# Altium project UZ_per_cb_upgrade.PrjPcb (part 2 of 3)

## Sheet S2C.SchDoc
size A4; SheetNumber: 11
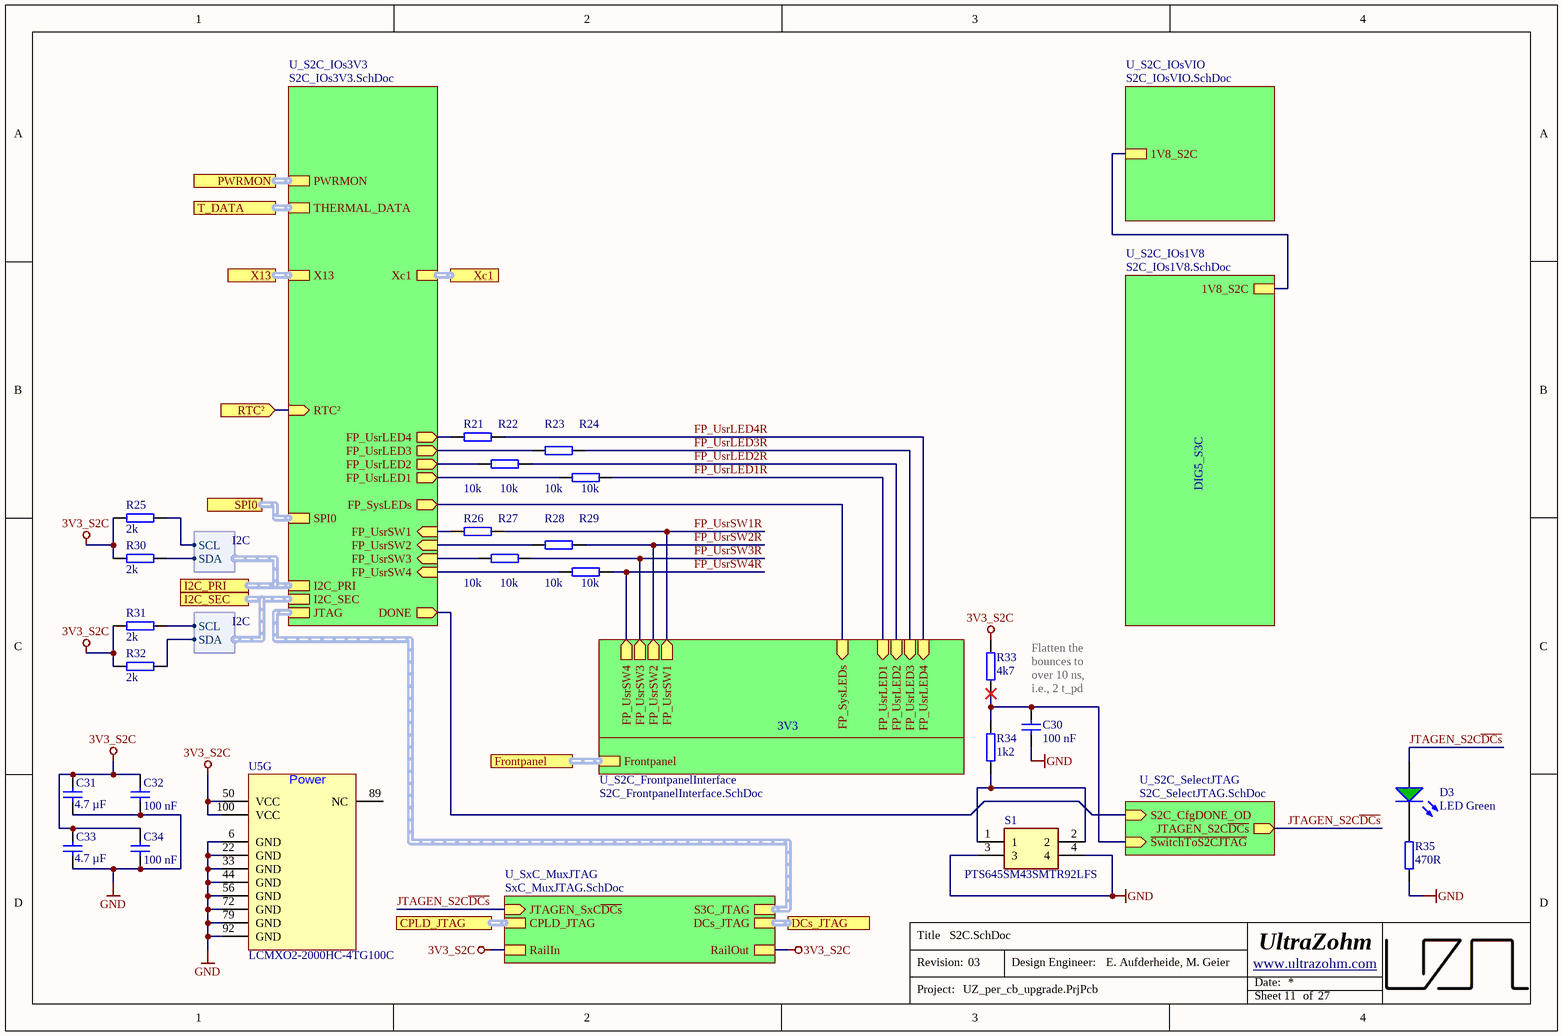
[diagram p8: S2C.SchDoc]

### Parts
C30  100 nF  [C_0603_TE]
C31  4.7 µF  [C_0603_TE]
C32  100 nF  [C_0603_TE]
C33  4.7 µF  [C_0603_TE]
C34  100 nF  [C_0603_TE]
D3  LED Green  [WL-SMCW_0603]
R21  10k  [R_0603_TE]
R22  10k  [R_0603_TE]
R23  10k  [R_0603_TE]
R24  10k  [R_0603_TE]
R25  2k  [R_0603_TE]
R26  10k  [R_0603_TE]
R27  10k  [R_0603_TE]
R28  10k  [R_0603_TE]
R29  10k  [R_0603_TE]
R30  2k  [R_0603_TE]
R31  2k  [R_0603_TE]
R32  2k  [R_0603_TE]
R33  4k7  [R_0603_TE]
R34  1k2  [R_0603_TE]
R35  470R  [R_0603_TE]
S1  PTS645SM43SMTR92LFS  [PTS645_SMT]
U5  LCMXO2-2000HC-4TG100C  [QFP50P1600X1600X160-100N]  (part G of 7)

### Sub-sheets
U_S2C_FrontpanelInterface = S2C_FrontpanelInterface.SchDoc: FP_UsrSW4 (out), FP_UsrSW3 (out), FP_UsrSW2 (out), FP_UsrSW1 (out), FP_UsrLED4 (in), FP_UsrLED3 (in), FP_UsrLED2 (in), FP_UsrLED1 (in), Frontpanel (harness Frontpanel), FP_SysLEDs (in)
U_S2C_IOs1V8 = S2C_IOs1V8.SchDoc: 1V8_S2C
U_S2C_IOs3V3 = S2C_IOs3V3.SchDoc: JTAG (harness JTAG_S3C), I2C_PRI (harness I2C), THERMAL_DATA (harness T_DATA), PWRMON (harness S2C_PWRMON), FP_UsrSW3 (in), FP_UsrSW2 (in), FP_UsrSW1 (in), FP_UsrLED1 (out), FP_SysLEDs (out), I2C_SEC (harness I2C), FP_UsrSW4 (in), FP_UsrLED2 (out), FP_UsrLED3 (out), FP_UsrLED4 (out), DONE (out), SPI0 (harness SPI0), X13 (harness X13), Xc1 (harness Xc1), RTC² (in)
U_S2C_IOsVIO = S2C_IOsVIO.SchDoc: 1V8_S2C
U_S2C_SelectJTAG = S2C_SelectJTAG.SchDoc: JTAGEN_S2C~{DCs} (out), ~{SwitchToS2CJTAG} (in), S2C_CfgDONE_OD (in)
U_SxC_MuxJTAG = SxC_MuxJTAG.SchDoc (file not in this document): CPLD_JTAG (harness JTAG), JTAGEN_SxC~{DCs} (in), S3C_JTAG (harness JTAG_S3C), DCs_JTAG (harness JTAG), RailIn, RailOut  | SubSheet_SheetNumber: 17

### Ports
CPLD_JTAG (harness JTAG), DCs_JTAG (harness JTAG), Frontpanel (harness Frontpanel), I2C_PRI (harness I2C), I2C_SEC (harness I2C), PWRMON (harness S2C_PWRMON), RTC² (in), SPI0 (harness SPI0), T_DATA (harness T_DATA), X13 (harness X13), Xc1 (harness Xc1)

### Harnesses
I2C: SCL, SDA

### Nets
3V3_S2C: C31.1 C32.2 C33.1 C34.2 R25.2 R30.2 R31.2 R32.2 R33.2 U5.50(VCC) U5.100(VCC) ; sheet U_SxC_MuxJTAG/RailIn, sheet U_SxC_MuxJTAG/RailOut
GND: C30.1 C31.2 C32.1 C33.2 C34.1 R35.2 S1.3 S1.4 U5.6(GND) U5.22(GND) U5.33(GND) U5.44(GND) U5.56(GND) U5.72(GND) U5.79(GND) U5.92(GND)
1V8_S2C: sheet U_S2C_IOs1V8/1V8_S2C, sheet U_S2C_IOsVIO/1V8_S2C
DONE: sheet U_S2C_IOs3V3/DONE, sheet U_S2C_SelectJTAG/S2C_CfgDONE_OD
FOUT: port RTC², sheet U_S2C_IOs3V3/RTC²
FP_SysLEDs: sheet U_S2C_IOs3V3/FP_SysLEDs, sheet U_S2C_FrontpanelInterface/FP_SysLEDs
FP_UsrLED1: R24.1 ; sheet U_S2C_IOs3V3/FP_UsrLED1
FP_UsrLED1R: R24.2 ; sheet U_S2C_FrontpanelInterface/FP_UsrLED1
FP_UsrLED2: R22.1 ; sheet U_S2C_IOs3V3/FP_UsrLED2
FP_UsrLED2R: R22.2 ; sheet U_S2C_FrontpanelInterface/FP_UsrLED2
FP_UsrLED3: R23.1 ; sheet U_S2C_IOs3V3/FP_UsrLED3
FP_UsrLED3R: R23.2 ; sheet U_S2C_FrontpanelInterface/FP_UsrLED3
FP_UsrLED4: R21.1 ; sheet U_S2C_IOs3V3/FP_UsrLED4
FP_UsrLED4R: R21.2 ; sheet U_S2C_FrontpanelInterface/FP_UsrLED4
FP_UsrSW1: R26.1 ; sheet U_S2C_IOs3V3/FP_UsrSW1
FP_UsrSW1R: R26.2 ; sheet U_S2C_FrontpanelInterface/FP_UsrSW1
FP_UsrSW2: R28.1 ; sheet U_S2C_IOs3V3/FP_UsrSW2
FP_UsrSW2R: R28.2 ; sheet U_S2C_FrontpanelInterface/FP_UsrSW2
FP_UsrSW3: R27.1 ; sheet U_S2C_IOs3V3/FP_UsrSW3
FP_UsrSW3R: R27.2 ; sheet U_S2C_FrontpanelInterface/FP_UsrSW3
FP_UsrSW4: R29.1 ; sheet U_S2C_IOs3V3/FP_UsrSW4
FP_UsrSW4R: R29.2 ; sheet U_S2C_FrontpanelInterface/FP_UsrSW4
JTAGEN_S2C~{DCs}: D3.2(A) ; sheet U_SxC_MuxJTAG/JTAGEN_SxC~{DCs}, sheet U_S2C_SelectJTAG/JTAGEN_S2C~{DCs}
~{SwitchToS2CJTAG}: C30.2 R33.1 R34.2 ; sheet U_S2C_SelectJTAG/~{SwitchToS2CJTAG}
NetD3_1: D3.1(K) R35.1
NetR25_1: R25.1 ; port I2C_PRI.SCL
NetR30_1: R30.1 ; port I2C_PRI.SDA
NetR31_1: R31.1 ; port I2C_SEC.SCL
NetR32_1: R32.1 ; port I2C_SEC.SDA
NetR34_1: R34.1 S1.1 S1.2

Not connected (* = marked no-connect by the designer): U5 89(NC)

### Buses and harness runs
harness port CPLD_JTAG = sheet U_SxC_MuxJTAG/CPLD_JTAG
harness port DCs_JTAG = sheet U_SxC_MuxJTAG/DCs_JTAG
harness port Frontpanel = sheet U_S2C_FrontpanelInterface/Frontpanel
harness port I2C_PRI = sheet U_S2C_IOs3V3/I2C_PRI
harness port I2C_SEC = sheet U_S2C_IOs3V3/I2C_SEC
harness port PWRMON = sheet U_S2C_IOs3V3/PWRMON
harness port SPI0 = sheet U_S2C_IOs3V3/SPI0
harness port T_DATA = sheet U_S2C_IOs3V3/THERMAL_DATA
harness port X13 = sheet U_S2C_IOs3V3/X13
harness port Xc1 = sheet U_S2C_IOs3V3/Xc1
harness sheet U_S2C_IOs3V3/JTAG = sheet U_SxC_MuxJTAG/S3C_JTAG

### Notes on the sheet
- DIG5_S3C
- Flatten the bounces to over 10 ns, i.e., 2 t_pd
- 3V3
- Title
- Revision:
- Design Engineer:
- Date:
- Project:
- Sheet
- of
- (in symbol LCMXO2-2000HC-4TG100C, part G) Power

### Library data of the parts
C30 = UZgen_C_0603_100nF_50V_X7R: Generic capacitor; Manufacturer: UZgen; Voltage: 50V; Tolerance: 10 %; Created from: AGeiger; Manufacturer Part Number: UZgen_C_0603_100nF_50V_X7R; PartID: 1; Created On: 02/07/2024 14:42:23; Value: 100 nF; Device Package: 0603; Technology: X7R; Mounting Type: SMD; Last Updated: 08/08/2024 15:01:15
C31 C33 = UZgen_C_0603_4.7uF_16V_X5R: Generic capacitor; Manufacturer: UZgen; Voltage: 16V; Tolerance: 10 %; Created from: MGeier; Manufacturer Part Number: UZgen_C_0603_4.7uF_16V_X5R; PartID: 5809; Created On: 20/03/2025 14:43:45; Value: 4.7 µF; Device Package: 0603; Technology: X5R; Mounting Type: SMD; Last Updated: 20/03/2025 14:43:45
C32 C34 = UZgen_C_0603_100nF_50V_X7R: Generic capacitor; Manufacturer: UZgen; Tolerance: 10 %; Voltage: 50 V; Created from: AGeiger; Value: 100 nF; Technology: X7R; Manufacturer Part Number: UZgen_C_0603_100nF_50V_X7R; PartID: 1; Created On: 02/07/2024 14:42:23; Device Package: 0603; Mounting Type: SMD; Last Updated: 02/08/2024 14:45:57
D3 = UZgen_LED_0603_Green: Standard LEDs - SMD 0603 green; Manufacturer: UZgen; Created from: UZgenTool; Manufacturer Part Number: UZgen_LED_0603_Green; PartID: 21; Created On: 09/09/2024 10:45:01; ComponentLink1Description: N/A; ComponentLink1URL: N/A; Component Type: LED Diode; Device Package: 0603; Last Updated: 09/09/2024 10:45:01; Mounting Type: SMD; Supplier 1: LCSC; Supplier Part Number 1: =LCSC Part Number; Type: Standard; Value: LED Green; Live Cycle Status: 1; Stock number: not stored; Color: green
R21-R24 R26-R29 = UZgen_R_0603_10k: Generic resistor; Manufacturer: UZgen; Tolerance: 1 %; Created from: AGeiger; Value: 10k; Manufacturer Part Number: UZgen_R_0603_10k; PartID: 1; Created On: 02/07/2024 14:34:53; Device Package: 0603; Mounting Type: SMD; Last Updated: 02/07/2024 14:37:16
R25 R30-R32 = UZgen_R_0603_2k: Generic resistor; Manufacturer: UZgen; Tolerance: 1 %; Created from: UZgenTool; Value: 2k; Manufacturer Part Number: UZgen_R_0603_2k; PartID: 228; Created On: 02/07/2024 17:29:49; Device Package: 0603; Mounting Type: SMD; Last Updated: 02/07/2024 17:29:49
R33 = UZgen_R_0603_4k7: Generic resistor; Manufacturer: UZgen; Tolerance: 1 %; Created from: UZgenTool; Manufacturer Part Number: UZgen_R_0603_4k7; PartID: 237; Created On: 02/07/2024 17:29:50; Value: 4k7; Device Package: 0603; Mounting Type: SMD; Last Updated: 02/07/2024 17:29:50
R34 = UZgen_R_0603_1k2: Generic resistor; Manufacturer: UZgen; Tolerance: 1 %; Created from: UZgenTool; Manufacturer Part Number: UZgen_R_0603_1k2; PartID: 223; Created On: 02/07/2024 17:29:49; Value: 1k2; Device Package: 0603; Mounting Type: SMD; Last Updated: 02/07/2024 17:29:49
R35 = UZgen_R_0603_470R: Generic resistor; Manufacturer: UZgen; Tolerance: 1 %; Created from: UZgenTool; Manufacturer Part Number: UZgen_R_0603_470R; PartID: 213; Created On: 02/07/2024 17:29:49; Value: 470R; Device Package: 0603; Mounting Type: SMD; Last Updated: 02/07/2024 17:29:49
S1 = PTS645SM43SMTR92LFS: 50mA SPST 160gf 12V SMD-4P,6x6mm Tactile Switches ROHS; Manufacturer_Name: C & K COMPONENTS; Manufacturer: C&K COMPONENTS; Value: Push Button; Created from: AGeiger; Datasheet Link: https://www.ckswitches.com/media/1471/pts645.pdf; Manufacturer_Part_Number: PTS645SM43SMTR92LFS; Mouser Part Number: 611-PTS645SM43SMTR92; Mouser Price/Stock: https://www.mouser.co.uk/ProductDetail/CK/PTS645SM43SMTR92LFS?qs=FESYatJ8odKPktxv6ncfWg%3D%3D; Arrow Part Number: PTS645SM43SMTR92LFS; Arrow Price/Stock: https://www.arrow.com/en/products/pts645sm43smtr92lfs/ck; Manufacturer Part Number: PTS645SM43SMTR92LFS; PartID: 24; Created On: 31/05/2023 15:31:02; ComponentLink1Description: Datasheet; ComponentLink1URL: https://datasheet.lcsc.com/lcsc/1810121628_C-K-PTS645SM43SMTR92LFS_C221880.pdf; Component Type: Tactile Switch; Device Package: SMD; Last Updated: 31/05/2023 15:31:02; Mounting Type: SMD; Operating Temperature: -20 to +60 °C; Supplier 1: Mouser; Supplier Part Number 1: 611-PTS645SM43SMTR92; Supplier 2: LCSC; Supplier Part Number 2: C221880; Type: Tactile Switch; Live Cycle Status: 1; LCSC Part Number: C221880
U5 = LCMXO2-2000HC-4TG100C: TQFP-100(14x14) Programmable Logic Device (CPLDs/FPGAs) ROHS; Manufacturer: Lattice; Created from: FRosner; Manufacturer Part Number: LCMXO2-2000HC-4TG100C; PartID: 37; Created On: 03/07/2024 17:33:36; ComponentLink1Description: Datasheet; ComponentLink1URL: https://wmsc.lcsc.com/wmsc/upload/file/pdf/v2/lcsc/2403111456_Lattice-LCMXO2-2000HC-4TG100C_C1521632.pdf; Component Type: CPLD; Device Package: TQFP-100; Last Updated: 23/08/2024 11:42:29; Mounting Type: SMD; Operating Temperature: -0 to +85 °C; Supplier 1: LCSC; Supplier Part Number 1: C1521632; Supplier 2: Mouser; Supplier Part Number 2: 842-XO22000HC4TG100C; Type: CPLD; Live Cycle Status: 1; LCSC Part Number: C1521632; Stock number: not stored

## Sheet S2C_IOs3V3.SchDoc
size A4; SheetNumber: 12
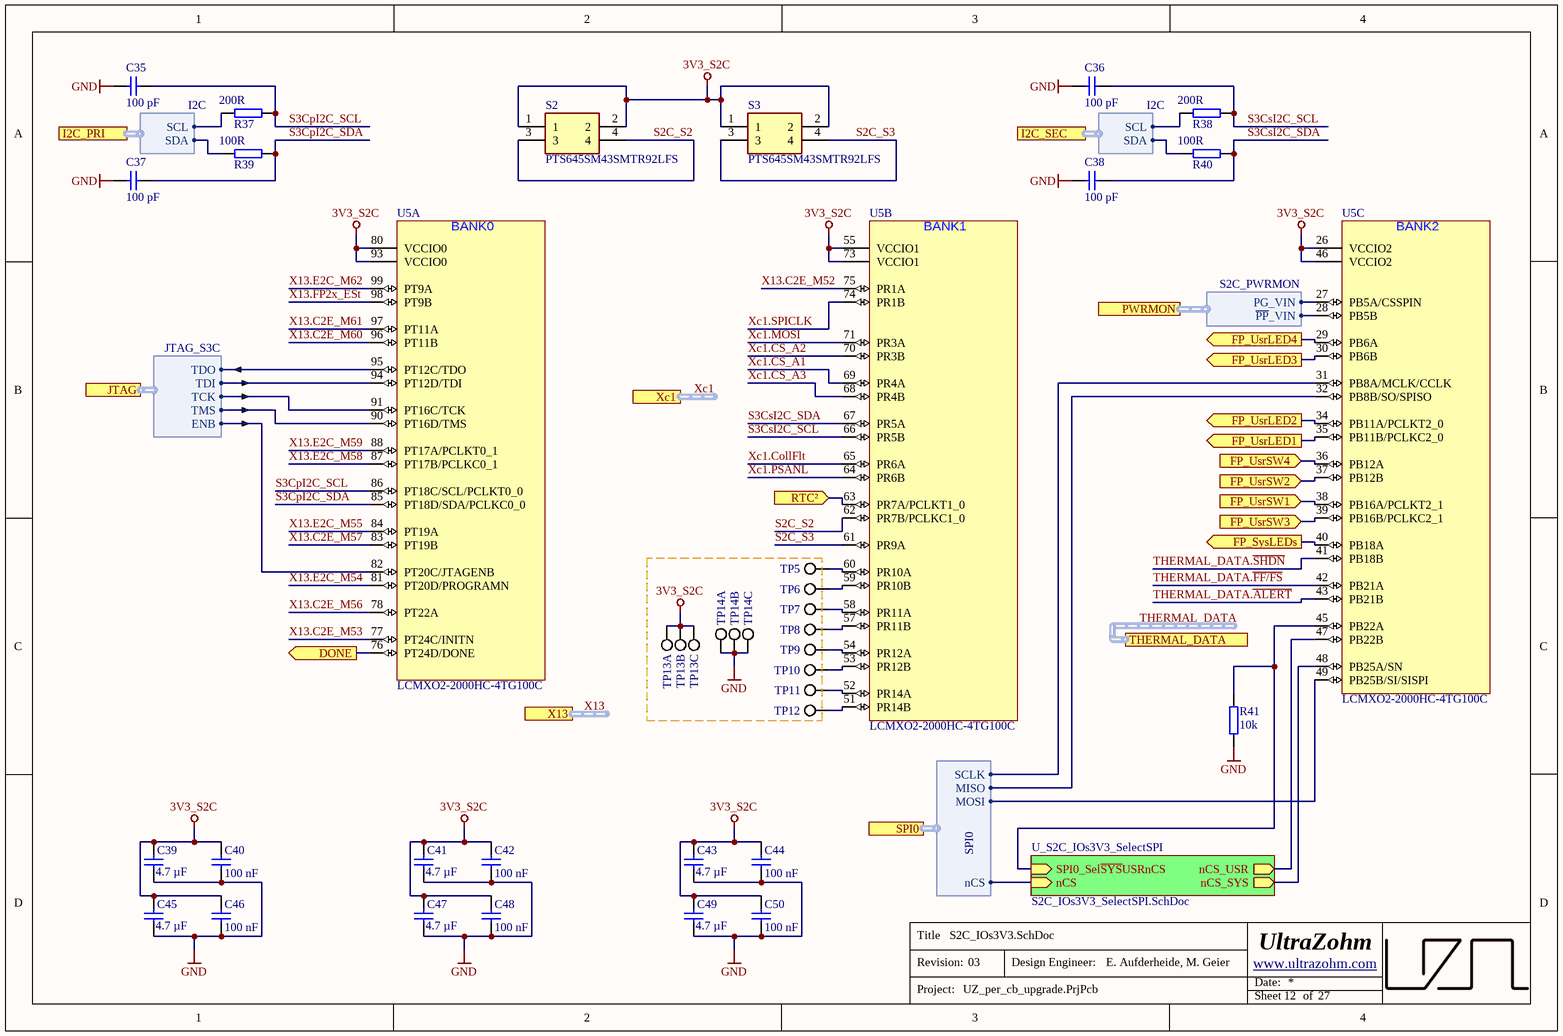
[diagram p9: S2C_IOs3V3.SchDoc]

### Parts
C35  100 pF  [C_0603_TE]
C36  100 pF  [C_0603_TE]
C37  100 pF  [C_0603_TE]
C38  100 pF  [C_0603_TE]
C39  4.7 µF  [C_0603_TE]
C40  100 nF  [C_0603_TE]
C41  4.7 µF  [C_0603_TE]
C42  100 nF  [C_0603_TE]
C43  4.7 µF  [C_0603_TE]
C44  100 nF  [C_0603_TE]
C45  4.7 µF  [C_0603_TE]
C46  100 nF  [C_0603_TE]
C47  4.7 µF  [C_0603_TE]
C48  100 nF  [C_0603_TE]
C49  4.7 µF  [C_0603_TE]
C50  100 nF  [C_0603_TE]
R37  200R  [R_0603_TE]
R38  200R  [R_0603_TE]
R39  100R  [R_0603_TE]
R40  100R  [R_0603_TE]
R41  10k  [R_0603_TE]
S2  PTS645SM43SMTR92LFS  [PTS645_SMT]
S3  PTS645SM43SMTR92LFS  [PTS645_SMT]
TP5  PR10A  [FP-5015-MFG]  (value not drawn)
TP6  PR10B  [FP-5015-MFG]  (value not drawn)
TP7  PR11A  [FP-5015-MFG]  (value not drawn)
TP8  PR11B  [FP-5015-MFG]  (value not drawn)
TP9  PR12A  [FP-5015-MFG]  (value not drawn)
TP10  PR12B  [FP-5015-MFG]  (value not drawn)
TP11  PR14A  [FP-5015-MFG]  (value not drawn)
TP12  PR14B  [FP-5015-MFG]  (value not drawn)
TP13A  3V3_S2C  [FP-5015-MFG]  (value not drawn)
TP13B  3V3_S2C  [FP-5015-MFG]  (value not drawn)
TP13C  3V3_S2C  [FP-5015-MFG]  (value not drawn)
TP14A  GND  [FP-5015-MFG]  (value not drawn)
TP14B  GND  [FP-5015-MFG]  (value not drawn)
TP14C  GND  [FP-5015-MFG]  (value not drawn)
U5  LCMXO2-2000HC-4TG100C  [QFP50P1600X1600X160-100N]  (parts A,B,C of 7)

### Sub-sheets
U_S2C_IOs3V3_SelectSPI = S2C_IOs3V3_SelectSPI.SchDoc: nCS (in), SPI0_Sel~{SYS}USRnCS (in), nCS_USR (out), nCS_SYS (out)

### Ports
DONE (out), FP_SysLEDs (out), FP_UsrLED1 (out), FP_UsrLED2 (out), FP_UsrLED3 (out), FP_UsrLED4 (out), FP_UsrSW1 (in), FP_UsrSW2 (in), FP_UsrSW3 (in), FP_UsrSW4 (in), I2C_PRI (harness I2C), I2C_SEC (harness I2C), JTAG (harness JTAG_S3C), PWRMON (harness S2C_PWRMON), RTC² (in), SPI0 (harness SPI0), THERMAL_DATA (harness T_DATA), X13 (harness X13), Xc1 (harness Xc1)

### Harnesses
JTAG_S3C: TDO, TDI, TCK, TMS, ENB
I2C: SCL, SDA
SPI0: SCLK, MOSI, MISO, nCS
S2C_PWRMON: PG_VIN, ~{PP}_VIN

### Nets
3V3_S2C: C39.1 C40.2 C41.1 C42.2 C43.1 C44.2 C45.1 C46.2 C47.1 C48.2 C49.1 C50.2 S2.1 S2.2 S3.1 S3.2 TP13A.1 TP13B.1 TP13C.1 U5.26(VCCIO2) U5.46(VCCIO2) U5.55(VCCIO1) U5.73(VCCIO1) U5.80(VCCIO0) U5.93(VCCIO0)
GND: C35.2 C36.2 C37.2 C38.2 C39.2 C40.1 C41.2 C42.1 C43.2 C44.1 C45.2 C46.1 C47.2 C48.1 C49.2 C50.1 R41.1 TP14A.1 TP14B.1 TP14C.1
DONE: U5.76(PT24D/DONE) ; port DONE
FOUT: U5.63(PR7A/PCLKT1_0) ; port RTC²
FP_SysLEDs: U5.40(PB18A) ; port FP_SysLEDs
FP_UsrLED1: U5.35(PB11B/PCLKC2_0) ; port FP_UsrLED1
FP_UsrLED2: U5.34(PB11A/PCLKT2_0) ; port FP_UsrLED2
FP_UsrLED3: U5.30(PB6B) ; port FP_UsrLED3
FP_UsrLED4: U5.29(PB6A) ; port FP_UsrLED4
FP_UsrSW1: U5.38(PB16A/PCLKT2_1) ; port FP_UsrSW1
FP_UsrSW2: U5.37(PB12B) ; port FP_UsrSW2
FP_UsrSW3: U5.39(PB16B/PCLKC2_1) ; port FP_UsrSW3
FP_UsrSW4: U5.36(PB12A) ; port FP_UsrSW4
nCS: sheet U_S2C_IOs3V3_SelectSPI/nCS, port SPI0.nCS
nCS_SYS: U5.48(PB25A/SN) ; sheet U_S2C_IOs3V3_SelectSPI/nCS_SYS
nCS_USR: U5.47(PB22B) ; sheet U_S2C_IOs3V3_SelectSPI/nCS_USR
S2C_S2: S2.3 S2.4 U5.62(PR7B/PCLKC1_0)
S2C_S3: S3.3 S3.4 U5.61(PR9A)
S3CpI2C_SCL: C35.1 R37.2 U5.86(PT18C/SCL/PCLKT0_0)
S3CpI2C_SDA: C37.1 R39.2 U5.85(PT18D/SDA/PCLKC0_0)
S3CsI2C_SCL: C36.1 R38.2 U5.66(PR5B)
S3CsI2C_SDA: C38.1 R40.2 U5.67(PR5A)
SPI0_Sel~{SYS}USRnCS: R41.2 U5.45(PB22A) ; sheet U_S2C_IOs3V3_SelectSPI/SPI0_Sel~{SYS}USRnCS
THERMAL_DATA.~{ALERT}: U5.43(PB21B)
THERMAL_DATA.~{FF/FS}: U5.42(PB21A)
THERMAL_DATA.~{SHDN}: U5.41(PB18B)
X13.C2E_M52: U5.75(PR1A)
X13.C2E_M53: U5.77(PT24C/INITN)
X13.C2E_M56: U5.78(PT22A)
X13.C2E_M57: U5.83(PT19B)
X13.C2E_M60: U5.96(PT11B)
X13.C2E_M61: U5.97(PT11A)
X13.E2C_M54: U5.81(PT20D/PROGRAMN)
X13.E2C_M55: U5.84(PT19A)
X13.E2C_M58: U5.87(PT17B/PCLKC0_1)
X13.E2C_M59: U5.88(PT17A/PCLKT0_1)
X13.E2C_M62: U5.99(PT9A)
X13.FP2x_ESt: U5.98(PT9B)
Xc1.CollFlt: U5.65(PR6A)
Xc1.CS_A1: U5.69(PR4A)
Xc1.CS_A2: U5.70(PR3B)
Xc1.CS_A3: U5.68(PR4B)
Xc1.MOSI: U5.71(PR3A)
Xc1.PSANL: U5.64(PR6B)
Xc1.SPICLK: U5.74(PR1B)
NetR19_2: U5.27(PB5A/CSSPIN) ; port PWRMON.PG_VIN
NetR20_2: U5.28(PB5B) ; port PWRMON.~{PP}_VIN
NetR25_1: R37.1 ; port I2C_PRI.SCL
NetR30_1: R39.1 ; port I2C_PRI.SDA
NetR31_1: R38.1 ; port I2C_SEC.SCL
NetR32_1: R40.1 ; port I2C_SEC.SDA
NetTP5_1: TP5.1 U5.60(PR10A)
NetTP6_1: TP6.1 U5.59(PR10B)
NetTP7_1: TP7.1 U5.58(PR11A)
NetTP8_1: TP8.1 U5.57(PR11B)
NetTP9_1: TP9.1 U5.54(PR12A)
NetTP10_1: TP10.1 U5.53(PR12B)
NetTP11_1: TP11.1 U5.52(PR14A)
NetTP12_1: TP12.1 U5.51(PR14B)
NetU5_31: U5.31(PB8A/MCLK/CCLK) ; port SPI0.SCLK
NetU5_32: U5.32(PB8B/SO/SPISO) ; port SPI0.MISO
NetU5_49: U5.49(PB25B/SI/SISPI) ; port SPI0.MOSI
NetU5_82: U5.82(PT20C/JTAGENB) ; port JTAG.ENB
NetU5_90: U5.90(PT16D/TMS) ; port JTAG.TMS
NetU5_91: U5.91(PT16C/TCK) ; port JTAG.TCK
NetU5_94: U5.94(PT12D/TDI) ; port JTAG.TDI
NetU5_95: U5.95(PT12C/TDO) ; port JTAG.TDO

### Buses and harness runs
harness THERMAL_DATA = port THERMAL_DATA
harness X13 = port X13
harness Xc1 = port Xc1

### Notes on the sheet
- Title
- Revision:
- Design Engineer:
- Date:
- Project:
- Sheet
- of
- (in symbol LCMXO2-2000HC-4TG100C, part A) BANK0
- (in symbol LCMXO2-2000HC-4TG100C, part B) BANK1
- (in symbol LCMXO2-2000HC-4TG100C, part C) BANK2

### Library data of the parts
C35-C38 = UZgen_C_0603_100pF_50V_X7R: Generic capacitor; Manufacturer: UZgen; Voltage: 50V; Tolerance: 10 %; Created from: UZgenTool; Manufacturer Part Number: UZgen_C_0603_100pF_50V_X7R; PartID: 4215; Created On: 02/08/2024 11:18:08; Value: 100 pF; Device Package: 0603; Technology: X7R; Mounting Type: SMD; Last Updated: 02/08/2024 11:18:08
C39 C41 C43 C45 C47 C49 = UZgen_C_0603_4.7uF_16V_X5R: as C31 on sheet S2C; Manufacturer Part Number: UZgen_C_0603_4.7uF_16V_X5R; PartID: 5809; Created On: 20/03/2025 14:43:45; Value: 4.7 µF; Device Package: 0603; Technology: X5R; Mounting Type: SMD; Last Updated: 20/03/2025 14:43:45
C40 C42 C44 C46 C48 C50 = UZgen_C_0603_100nF_50V_X7R: as C32 on sheet S2C; Value: 100 nF; Technology: X7R; Manufacturer Part Number: UZgen_C_0603_100nF_50V_X7R; PartID: 1; Created On: 02/07/2024 14:42:23; Device Package: 0603; Mounting Type: SMD; Last Updated: 02/08/2024 14:45:57
R37 R38 = UZgen_R_0603_200R: Generic resistor; Manufacturer: UZgen; Tolerance: 1 %; Created from: UZgenTool; Manufacturer Part Number: UZgen_R_0603_200R; PartID: 204; Created On: 02/07/2024 17:29:49; Value: 200R; Device Package: 0603; Mounting Type: SMD; Last Updated: 02/07/2024 17:29:49
R39 R40 = UZgen_R_0603_100R: Generic resistor; Manufacturer: UZgen; Tolerance: 1 %; Created from: UZgenTool; Manufacturer Part Number: UZgen_R_0603_100R; PartID: 197; Created On: 02/07/2024 17:29:48; Value: 100R; Device Package: 0603; Mounting Type: SMD; Last Updated: 02/07/2024 17:29:48
R41 = UZgen_R_0603_10k: as R21 on sheet S2C; Manufacturer Part Number: UZgen_R_0603_10k; PartID: 1; Created On: 02/07/2024 14:34:53; Value: 10k; Device Package: 0603; Mounting Type: SMD; Last Updated: 02/07/2024 14:37:16
S2 S3 = PTS645SM43SMTR92LFS: as S1 on sheet S2C; Datasheet Link: https://www.ckswitches.com/media/1471/pts645.pdf; Manufacturer_Part_Number: PTS645SM43SMTR92LFS; Mouser Part Number: 611-PTS645SM43SMTR92; Mouser Price/Stock: https://www.mouser.co.uk/ProductDetail/CK/PTS645SM43SMTR92LFS?qs=FESYatJ8odKPktxv6ncfWg%3D%3D; Arrow Part Number: PTS645SM43SMTR92LFS; Arrow Price/Stock: https://www.arrow.com/en/products/pts645sm43smtr92lfs/ck; Manufacturer Part Number: PTS645SM43SMTR92LFS; PartID: 24; Created On: 31/05/2023 15:31:02; ComponentLink1Description: Datasheet; ComponentLink1URL: https://datasheet.lcsc.com/lcsc/1810121628_C-K-PTS645SM43SMTR92LFS_C221880.pdf; Component Type: Tactile Switch; Device Package: SMD; Last Updated: 31/05/2023 15:31:02; Mounting Type: SMD; Operating Temperature: -20 to +60 °C; Supplier 1: Mouser; Supplier Part Number 1: 611-PTS645SM43SMTR92; Supplier 2: LCSC; Supplier Part Number 2: C221880; Type: Tactile Switch; Live Cycle Status: 1; LCSC Part Number: C221880
TP5-TP12 TP13A TP13B TP13C TP14A TP14B TP14C = 5015: Circuit Board Hardware - PCB SM TEST POINT ON T&R - MINIATURE; Manufacturer Part Number: 5015; Manufacturer: Keystone Electronics; Created from: AGeiger; ComponentLink1Description: Datasheet; ComponentLink2URL: http://www.keyelco.com/product-pdf.cfm?p=1357; ComponentLink1URL: https://www.mouser.de/datasheet/2/215/015-744075.pdf; ComponentLink2Description: Datasheet; PartID: 26; Created On: 03/06/2023 11:19:55; Component Type: Circuit Board Hardware; Device Package: SMD; Last Updated: 03/06/2023 11:43:17; Mounting Type: SMD; Supplier 1: Mouser; Supplier Part Number 1: 534-5015; Type: PCB SMD Testpoint; Live Cycle Status: 1; LCSC Part Number: C5199798
  TP5: Value: PR10A
  TP6: Value: PR10B
  TP7: Value: PR11A
  TP8: Value: PR11B
  TP9: Value: PR12A
  TP10: Value: PR12B
  TP11: Value: PR14A
  TP12: Value: PR14B
  TP13A TP13B TP13C: Value: 3V3_S2C
  TP14A TP14B TP14C: Value: GND
U5 = LCMXO2-2000HC-4TG100C: as U5 on sheet S2C; Manufacturer Part Number: LCMXO2-2000HC-4TG100C; PartID: 37; Created On: 03/07/2024 17:33:36; ComponentLink1Description: Datasheet; ComponentLink1URL: https://wmsc.lcsc.com/wmsc/upload/file/pdf/v2/lcsc/2403111456_Lattice-LCMXO2-2000HC-4TG100C_C1521632.pdf; Component Type: CPLD; Device Package: TQFP-100; Last Updated: 23/08/2024 11:42:29; Mounting Type: SMD; Operating Temperature: -0 to +85 °C; Supplier 1: LCSC; Supplier Part Number 1: C1521632; Supplier 2: Mouser; Supplier Part Number 2: 842-XO22000HC4TG100C; Type: CPLD; Live Cycle Status: 1; LCSC Part Number: C1521632; Stock number: not stored

## Sheet S2C_IOs3V3_SelectSPI.SchDoc
size A4; SheetNumber: 13
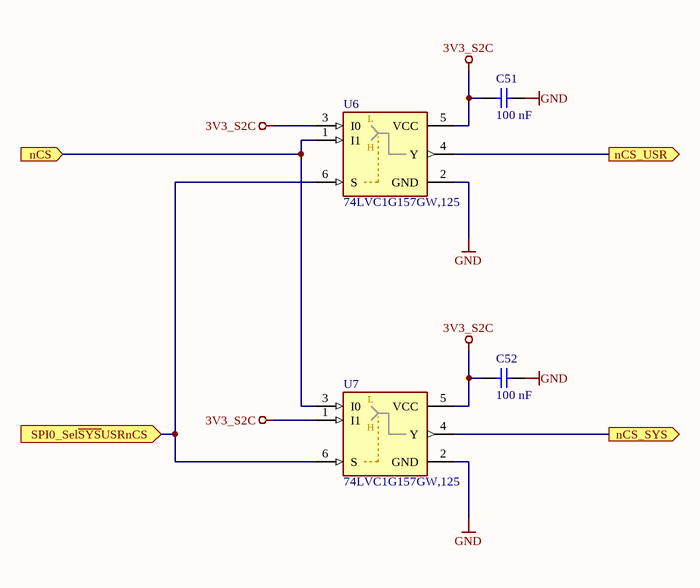
[diagram p10: S2C_IOs3V3_SelectSPI.SchDoc]

### Parts
C51  100 nF  [C_0603_TE]
C52  100 nF  [C_0603_TE]
U6  74LVC1G157GW,125  [SOT-363]
U7  74LVC1G157GW,125  [SOT-363]

### Ports
nCS (in), nCS_SYS (out), nCS_USR (out), SPI0_Sel~{SYS}USRnCS (in)

### Nets
3V3_S2C: C51.2 C52.2 U6.3(I0) U6.5(VCC) U7.1(I1) U7.5(VCC)
GND: C51.1 C52.1 U6.2(GND) U7.2(GND)
nCS: U6.1(I1) U7.3(I0) ; port nCS
nCS_SYS: U7.4(Y) ; port nCS_SYS
nCS_USR: U6.4(Y) ; port nCS_USR
SPI0_Sel~{SYS}USRnCS: U6.6(S) U7.6(S) ; port SPI0_Sel~{SYS}USRnCS

### Notes on the sheet
- Title
- Revision:
- Design Engineer:
- Date:
- Project:
- Sheet
- of
- (in symbol 74LVC1G157GW,125) L; H

### Library data of the parts
C51 C52 = UZgen_C_0603_100nF_50V_X7R: as C30 on sheet S2C; Manufacturer Part Number: UZgen_C_0603_100nF_50V_X7R; PartID: 1; Created On: 02/07/2024 14:42:23; Value: 100 nF; Device Package: 0603; Technology: X7R; Mounting Type: SMD; Last Updated: 08/08/2024 15:01:15
U6 U7 = 74LVC1G157GW,125: Single 2-input multiplexer; Manufacturer: Nexperia; Created from: MGeier; Manufacturer Part Number: 74LVC1G157GW,125; PartID: 21; Created On: 11/03/2025 22:40:00; ComponentLink1Description: Datasheet; ComponentLink1URL: https://assets.nexperia.com/documents/data-sheet/74LVC1G157.pdf; Component Type: Multiplexer; Device Package: TSSOP-6; Last Updated: 11/03/2025 22:40:00; Mounting Type: SMD; Operating Temperature: -40 - +125 °C; Supplier 1: LCSC; Supplier Part Number 1: C135822; Type: Multiplexer; Live Cycle Status: 1; LCSC Part Number: C135822

## Sheet S2C_IOs1V8.SchDoc
size A4; SheetNumber: 14
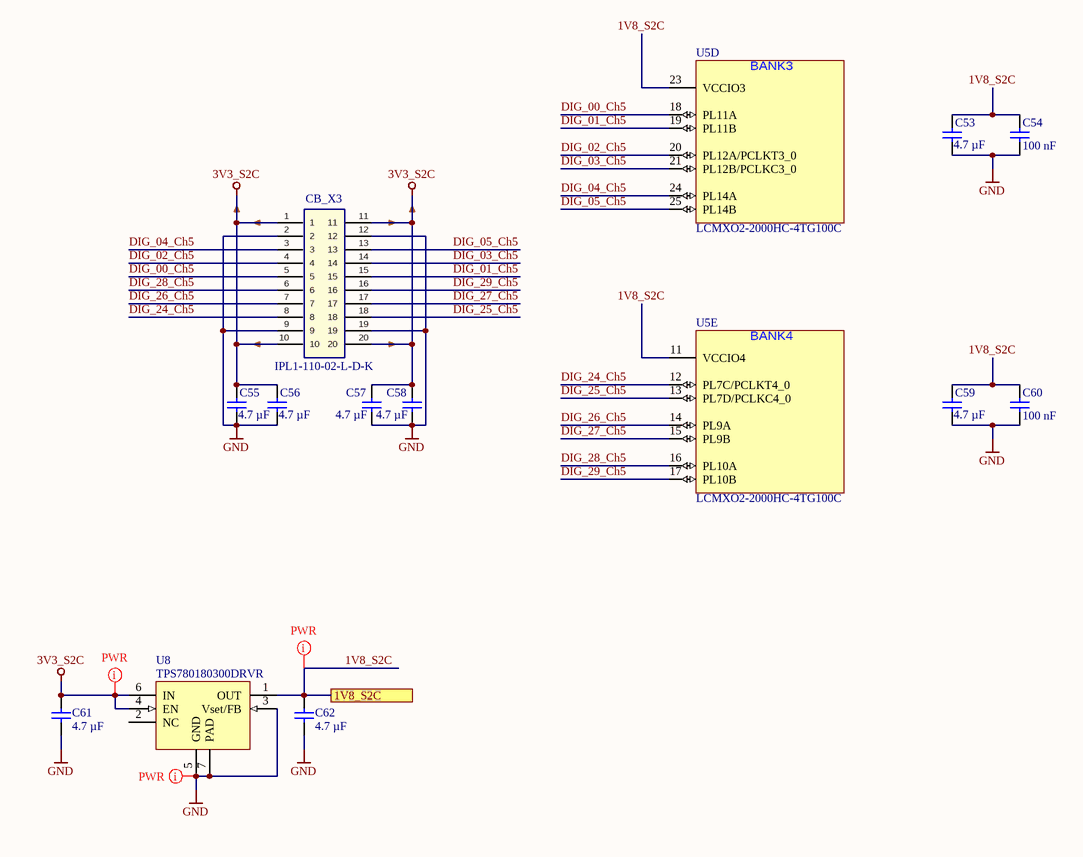
[diagram p11: S2C_IOs1V8.SchDoc]

### Parts
C53  4.7 µF  [C_0603_TE]
C54  100 nF  [C_0603_TE]
C55  4.7 µF  [C_0603_TE]
C56  4.7 µF  [C_0603_TE]
C57  4.7 µF  [C_0603_TE]
C58  4.7 µF  [C_0603_TE]
C59  4.7 µF  [C_0603_TE]
C60  100 nF  [C_0603_TE]
C61  4.7 µF  [C_0603_TE]
C62  4.7 µF  [C_0603_TE]
CB_X3  IPL1-110-02-L-D-K  [IPL1-110-02-L-D-K]
U5  LCMXO2-2000HC-4TG100C  [QFP50P1600X1600X160-100N]  (parts D,E of 7)
U8  TPS780180300DRVR  [SON65P200X200X80-7N]

### Ports
1V8_S2C

### Nets
3V3_S2C: C55.1 C56.1 C57.1 C58.1 C61.2 CB_X3.1 CB_X3.10 CB_X3.11 CB_X3.20 U8.4(EN) U8.6(IN)
GND: C53.2 C54.1 C55.2 C56.2 C57.2 C58.2 C59.2 C60.1 C61.1 C62.1 CB_X3.2 CB_X3.9 CB_X3.12 CB_X3.19 U8.3(Vset/FB) U8.5(GND) U8.7(PAD)
1V8_S2C: C53.1 C54.2 C59.1 C60.2 C62.2 U5.11(VCCIO4) U5.23(VCCIO3) U8.1(OUT) ; port 1V8_S2C
DIG_00_Ch5: CB_X3.5 U5.18(PL11A)
DIG_01_Ch5: CB_X3.15 U5.19(PL11B)
DIG_02_Ch5: CB_X3.4 U5.20(PL12A/PCLKT3_0)
DIG_03_Ch5: CB_X3.14 U5.21(PL12B/PCLKC3_0)
DIG_04_Ch5: CB_X3.3 U5.24(PL14A)
DIG_05_Ch5: CB_X3.13 U5.25(PL14B)
DIG_24_Ch5: CB_X3.8 U5.12(PL7C/PCLKT4_0)
DIG_25_Ch5: CB_X3.18 U5.13(PL7D/PCLKC4_0)
DIG_26_Ch5: CB_X3.7 U5.14(PL9A)
DIG_27_Ch5: CB_X3.17 U5.15(PL9B)
DIG_28_Ch5: CB_X3.6 U5.16(PL10A)
DIG_29_Ch5: CB_X3.16 U5.17(PL10B)

Not connected (* = marked no-connect by the designer): U8 2(NC)

### Layout directives
net class PWR: 1V8_S2C, 3V3_S2C, GND

### Notes on the sheet
- Title
- Revision:
- Design Engineer:
- Date:
- Project:
- Sheet
- of
- (in symbol LCMXO2-2000HC-4TG100C, part D) BANK3
- (in symbol LCMXO2-2000HC-4TG100C, part E) BANK4

### Library data of the parts
C53 C55-C59 C61 C62 = UZgen_C_0603_4.7uF_16V_X5R: as C31 on sheet S2C; Manufacturer Part Number: UZgen_C_0603_4.7uF_16V_X5R; PartID: 5809; Created On: 20/03/2025 14:43:45; Value: 4.7 µF; Device Package: 0603; Technology: X5R; Mounting Type: SMD; Last Updated: 20/03/2025 14:43:45
C54 C60 = UZgen_C_0603_100nF_50V_X7R: as C32 on sheet S2C; Value: 100 nF; Technology: X7R; Manufacturer Part Number: UZgen_C_0603_100nF_50V_X7R; PartID: 1; Created On: 02/07/2024 14:42:23; Device Package: 0603; Mounting Type: SMD; Last Updated: 02/08/2024 14:45:57
CB_X3 = IPL1-110-02-L-D-K: 2.54 mm Double Row Termin Assembly (SMD); Manufacturer: SAMTEC; Created from: MGremer; Number of positions: 10; Manufacturer Part Number: IPL1-110-02-L-D-K; PartID: 21; Created On: 30/11/2020 10:38:50; ComponentLink1Description: Homepage; ComponentLink1URL: https://www.samtec.com/products/ipl1; Component Type: Samtec Connector; Device Package: Connector; Last Updated: 01/04/2025 14:15:00; Mounting Type: THT; Supplier 1: SAMTEC; Supplier Part Number 1: IPL1-110-02-L-D-K; Supplier 2: Digi-Key; Supplier Part Number 2: SAM10586-ND; Supplier 3: LCSC; Supplier Part Number 3: C7544188; Type: Connector; Live Cycle Status: 1; Number of rows: 2; Stock number: not stored; LCSC Part Number: C7544188
U5 = LCMXO2-2000HC-4TG100C: as U5 on sheet S2C; Manufacturer Part Number: LCMXO2-2000HC-4TG100C; PartID: 37; Created On: 03/07/2024 17:33:36; ComponentLink1Description: Datasheet; ComponentLink1URL: https://wmsc.lcsc.com/wmsc/upload/file/pdf/v2/lcsc/2403111456_Lattice-LCMXO2-2000HC-4TG100C_C1521632.pdf; Component Type: CPLD; Device Package: TQFP-100; Last Updated: 23/08/2024 11:42:29; Mounting Type: SMD; Operating Temperature: -0 to +85 °C; Supplier 1: LCSC; Supplier Part Number 1: C1521632; Supplier 2: Mouser; Supplier Part Number 2: 842-XO22000HC4TG100C; Type: CPLD; Live Cycle Status: 1; LCSC Part Number: C1521632; Stock number: not stored
U8 = TPS780180300DRVR: LDO Voltage Regulators 150mA,LDO Reg,Ultra Low Pwr; Manufacturer: Texas Instruments; Value: 1.8 V, 3 V; Created from: FRosner; Manufacturer Part Number: TPS780180300DRVR; PartID: 17; Created On: 02/07/2024 16:16:00; ComponentLink1Description: Datasheet; ComponentLink1URL: https://wmsc.lcsc.com/wmsc/upload/file/pdf/v2/lcsc/2302220830_Texas-Instruments-TPS780180300DRVR_C2860011.pdf; Component Type: LDO; Device Package: SMD; Last Updated: 03/09/2024 16:21:15; Mounting Type: SMD; Operating Temperature: -40 to +125 °C; Series: TPS780; Supplier 1: Mouser; Supplier Part Number 1: 595-TPS780180300DRVR; Supplier 2: LCSC; Supplier Part Number 2: C2860011; Type: LDO; Live Cycle Status: 1; LCSC Part Number: C2860011; Stock number: not stored

## Sheet S2C_IOsVIO.SchDoc
size A4; SheetNumber: 15
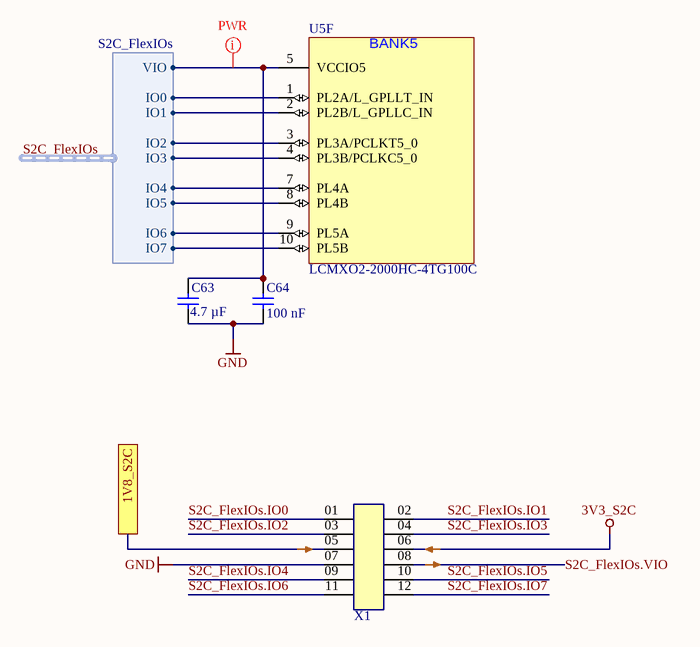
[diagram p12: S2C_IOsVIO.SchDoc]

### Parts
C63  4.7 µF  [C_0603_TE]
C64  100 nF  [C_0603_TE]
U5  LCMXO2-2000HC-4TG100C  [QFP50P1600X1600X160-100N]  (part F of 7)
X1  PH 0.1" SMD 2x06  [TSM-106-01-L-DV]  (value not drawn)

### Ports
1V8_S2C

### Harnesses
S2C_FlexIOs: VIO, IO0, IO1, IO2, IO3, IO4, IO5, IO6, IO7

### Nets
3V3_S2C: X1.06
GND: C63.2 C64.1 X1.07
1V8_S2C: X1.05 ; port 1V8_S2C
S2C_FlexIOs.IO0: U5.1(PL2A/L_GPLLT_IN) ; harness S2C_FlexIOs.IO0
S2C_FlexIOs.IO0: X1.01  [a separate net that carries the same name]
S2C_FlexIOs.IO1: U5.2(PL2B/L_GPLLC_IN) ; harness S2C_FlexIOs.IO1
S2C_FlexIOs.IO1: X1.02  [a separate net that carries the same name]
S2C_FlexIOs.IO2: U5.3(PL3A/PCLKT5_0) ; harness S2C_FlexIOs.IO2
S2C_FlexIOs.IO2: X1.03  [a separate net that carries the same name]
S2C_FlexIOs.IO3: U5.4(PL3B/PCLKC5_0) ; harness S2C_FlexIOs.IO3
S2C_FlexIOs.IO3: X1.04  [a separate net that carries the same name]
S2C_FlexIOs.IO4: U5.7(PL4A) ; harness S2C_FlexIOs.IO4
S2C_FlexIOs.IO4: X1.09  [a separate net that carries the same name]
S2C_FlexIOs.IO5: U5.8(PL4B) ; harness S2C_FlexIOs.IO5
S2C_FlexIOs.IO5: X1.10  [a separate net that carries the same name]
S2C_FlexIOs.IO6: U5.9(PL5A) ; harness S2C_FlexIOs.IO6
S2C_FlexIOs.IO6: X1.11  [a separate net that carries the same name]
S2C_FlexIOs.IO7: U5.10(PL5B) ; harness S2C_FlexIOs.IO7
S2C_FlexIOs.IO7: X1.12  [a separate net that carries the same name]
S2C_FlexIOs.VIO: C63.1 C64.2 U5.5(VCCIO5) ; harness S2C_FlexIOs.VIO
S2C_FlexIOs.VIO: X1.08  [a separate net that carries the same name]

### Layout directives
net class PWR: S2C_FlexIOs.VIO

### Notes on the sheet
- Title
- Revision:
- Design Engineer:
- Date:
- Project:
- Sheet
- of
- (in symbol LCMXO2-2000HC-4TG100C, part F) BANK5

### Library data of the parts
C63 = UZgen_C_0603_4.7uF_16V_X5R: as C31 on sheet S2C; Manufacturer Part Number: UZgen_C_0603_4.7uF_16V_X5R; PartID: 5809; Created On: 20/03/2025 14:43:45; Value: 4.7 µF; Device Package: 0603; Technology: X5R; Mounting Type: SMD; Last Updated: 20/03/2025 14:43:45
C64 = UZgen_C_0603_100nF_50V_X7R: as C32 on sheet S2C; Value: 100 nF; Technology: X7R; Manufacturer Part Number: UZgen_C_0603_100nF_50V_X7R; PartID: 1; Created On: 02/07/2024 14:42:23; Device Package: 0603; Mounting Type: SMD; Last Updated: 02/08/2024 14:45:57
U5 = LCMXO2-2000HC-4TG100C: as U5 on sheet S2C; Manufacturer Part Number: LCMXO2-2000HC-4TG100C; PartID: 37; Created On: 03/07/2024 17:33:36; ComponentLink1Description: Datasheet; ComponentLink1URL: https://wmsc.lcsc.com/wmsc/upload/file/pdf/v2/lcsc/2403111456_Lattice-LCMXO2-2000HC-4TG100C_C1521632.pdf; Component Type: CPLD; Device Package: TQFP-100; Last Updated: 23/08/2024 11:42:29; Mounting Type: SMD; Operating Temperature: -0 to +85 °C; Supplier 1: LCSC; Supplier Part Number 1: C1521632; Supplier 2: Mouser; Supplier Part Number 2: 842-XO22000HC4TG100C; Type: CPLD; Live Cycle Status: 1; LCSC Part Number: C1521632; Stock number: not stored
X1 = UZgen_Conn_PinHead_2x06_SMD_100mil_90deg: 0.1" Double-row Pin Header, 90°-to-PCB SMD, 2x06 Pins, 250V, 3A; Manufacturer: UZgen; Pin Pitch: 0.1" x 0.1"; Pin Orientation: 90° (standing); Created from: UZgenTool; Manufacturer Part Number: UZgen_Conn_PinHead_2x06_SMD_100mil_90deg; PartID: 5; Created On: 18/02/2025 11:27:30; Value: PH 0.1" SMD 2x06; Device Package: SMD 0.1" 2x06; Pin Count: 12; Pin Layout: 2x06; Pin Voltage: 250V; Pin Current: 3A; Mounting Type: SMD; Last Updated: 18/02/2025 11:27:30

## Sheet S2C_FrontpanelInterface.SchDoc
size A4; SheetNumber: 18
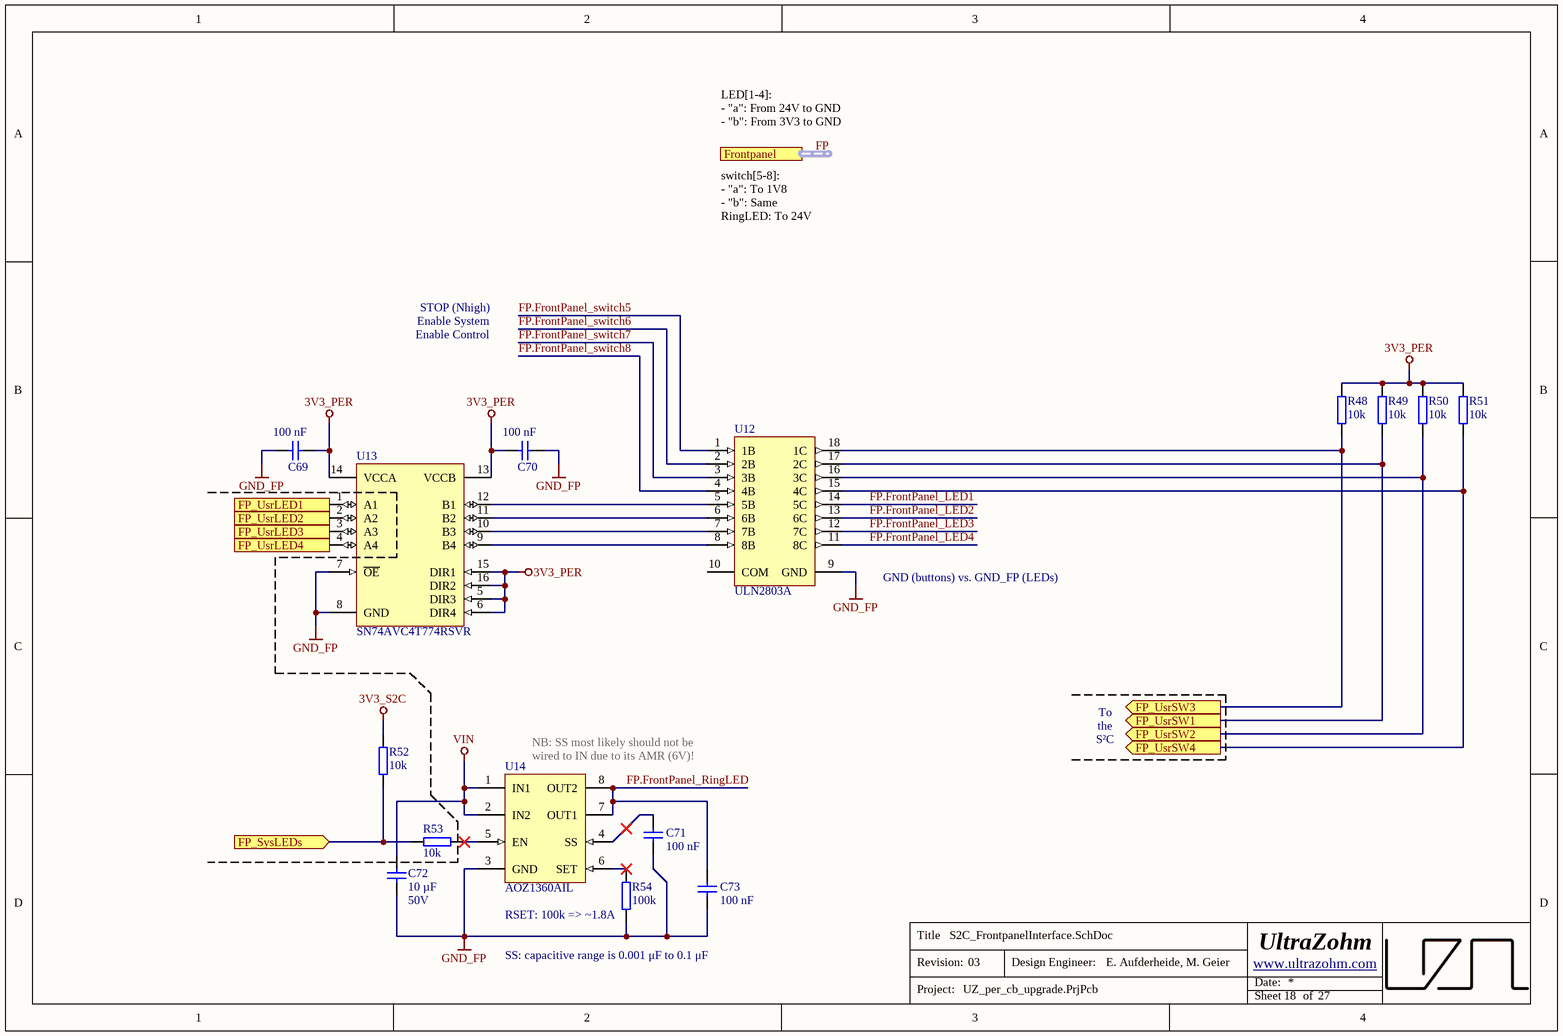
[diagram p13: S2C_FrontpanelInterface.SchDoc]

### Parts
C69  100 nF  [C_0603_TE]
C70  100 nF  [C_0603_TE]
C71  100 nF  [C_0603_TE]
C72  10 µF  Voltage: 50V  [C_1206_TE]
C73  100 nF  [C_0603_TE]
R48  10k  [R_0603_TE]
R49  10k  [R_0603_TE]
R50  10k  [R_0603_TE]
R51  10k  [R_0603_TE]
R52  10k  [R_0603_TE]
R53  10k  [R_0603_TE]
R54  100k  [R_0603_TE]
U12  ULN2803A  [FP-SOICW-18LD-PL-1-IPC_B]
U13  SN74AVC4T774RSVR  [QFN40P260X180X55-16N]
U14  AOZ1360AIL  [SOIC127P600X175-8N]

### Ports
FP_SysLEDs (in), FP_UsrLED1 (in), FP_UsrLED2 (in), FP_UsrLED3 (in), FP_UsrLED4 (in), FP_UsrSW1 (out), FP_UsrSW2 (out), FP_UsrSW3 (out), FP_UsrSW4 (out), Frontpanel (harness Frontpanel)

### Nets
3V3_PER: C69.2 C70.1 R48.2 R49.2 R50.2 R51.2 U13.5(DIR3) U13.6(DIR4) U13.13(VCCB) U13.14(VCCA) U13.15(DIR1) U13.16(DIR2)
3V3_S2C: R52.1
GND_FP: C69.1 C70.2 C71.2 C72.1 C73.2 R54.2 U12.9(GND) U13.7(~{OE}) U13.8(GND) U14.3(GND)
VIN: C72.2 U14.1(IN1) U14.2(IN2)
FP.FrontPanel_LED1: U12.14(5C)
FP.FrontPanel_LED2: U12.13(6C)
FP.FrontPanel_LED3: U12.12(7C)
FP.FrontPanel_LED4: U12.11(8C)
FP.FrontPanel_RingLED: C73.1 U14.7(OUT1) U14.8(OUT2)
FP.FrontPanel_switch5: U12.1(1B)
FP.FrontPanel_switch6: U12.2(2B)
FP.FrontPanel_switch7: U12.3(3B)
FP.FrontPanel_switch8: U12.4(4B)
FP_SysLEDs: R52.2 R53.1 ; port FP_SysLEDs
FP_UsrLED1R: U13.1(A1) ; port FP_UsrLED1
FP_UsrLED2R: U13.2(A2) ; port FP_UsrLED2
FP_UsrLED3R: U13.3(A3) ; port FP_UsrLED3
FP_UsrLED4R: U13.4(A4) ; port FP_UsrLED4
FP_UsrSW1R: R49.1 U12.17(2C) ; port FP_UsrSW1
FP_UsrSW2R: R50.1 U12.16(3C) ; port FP_UsrSW2
FP_UsrSW3R: R48.1 U12.18(1C) ; port FP_UsrSW3
FP_UsrSW4R: R51.1 U12.15(4C) ; port FP_UsrSW4
NetC71_1: C71.1 U14.4(SS)
NetR53_2: R53.2 U14.5(EN)
NetR54_1: R54.1 U14.6(SET)
NetU12_5: U12.5(5B) U13.12(B1)
NetU12_6: U12.6(6B) U13.11(B2)
NetU12_7: U12.7(7B) U13.10(B3)
NetU12_8: U12.8(8B) U13.9(B4)

Not connected (* = marked no-connect by the designer): U12 10(COM)

### Buses and harness runs
harness FP = port Frontpanel

### Notes on the sheet
- LED[1-4]:
  - "a": From 24V to GND
  - "b": From 3V3 to GND
- switch[5-8]:
  - "a": To 1V8
  - "b": Same
- RingLED: To 24V
- STOP (Nhigh)
- Enable System
- Enable Control
- GND (buttons) vs. GND_FP (LEDs)
- To
- (near U14) NB: SS most likely should not be wired to IN due to its AMR (6V)!
- the
- S²C
- (near R54) RSET: 100k => ~1.8A
- SS: capacitive range is 0.001 μF to 0.1 μF
- Title
- Revision:
- Design Engineer:
- Date:
- Project:
- Sheet
- of

### Library data of the parts
C69 C70 = UZgen_C_0603_100nF_50V_X7R: as C30 on sheet S2C; Manufacturer Part Number: UZgen_C_0603_100nF_50V_X7R; PartID: 1; Created On: 02/07/2024 14:42:23; Value: 100 nF; Device Package: 0603; Technology: X7R; Mounting Type: SMD; Last Updated: 08/08/2024 15:01:15
C71 C73 = UZgen_C_0603_100nF_50V_X7R: Generic capacitor; Manufacturer: UZgen; Tolerance: 10 %; Voltage: 50V; Created from: AGeiger; Technology: X7R; Value: 100 nF; Manufacturer Part Number: UZgen_C_0603_100nF_50V_X7R; PartID: 1; Created On: 02/07/2024 14:42:23; Device Package: 0603; Mounting Type: SMD; Last Updated: 08/08/2024 15:01:15
C72 = UZgen_C_1206_10uF_50V_X7R: Generic capacitor; Manufacturer: UZgen; Tolerance: 10 %; Created from: MGeier; Value: 10 µF; Manufacturer Part Number: UZgen_C_1206_10uF_50V_X7R; PartID: 5807; Created On: 20/03/2025 14:05:00; Device Package: 1206; Technology: X7R; Mounting Type: SMD; Last Updated: 20/03/2025 14:05:00
R48-R53 = UZgen_R_0603_10k: as R21 on sheet S2C; Manufacturer Part Number: UZgen_R_0603_10k; PartID: 1; Created On: 02/07/2024 14:34:53; Value: 10k; Device Package: 0603; Mounting Type: SMD; Last Updated: 02/07/2024 14:37:16
R54 = UZgen_R_0603_100k: Generic resistor; Manufacturer: UZgen; Tolerance: 1 %; Created from: UZgenTool; Value: 100k; Manufacturer Part Number: UZgen_R_0603_100k; PartID: 268; Created On: 02/07/2024 17:29:50; Device Package: 0603; Mounting Type: SMD; Last Updated: 02/07/2024 17:29:50
U12 = ULN2803A: Darlington Transistors Eight NPN Array; Manufacturer: UMW(Youtai Semiconductor Co., Ltd.); Created from: FRosner; Manufacturer Part Number: ULN2803A; PartID: 17; Created On: 13/06/2024 09:08:03; ComponentLink1Description: Datasheet; ComponentLink1URL: https://wmsc.lcsc.com/wmsc/upload/file/pdf/v2/lcsc/2311091738_UMW-Youtai-Semiconductor-Co---Ltd--ULN2803A_C845537.pdf; Component Type: Darlington Driver; Device Package: SOP-18; Last Updated: 04/09/2024 11:48:15; Mounting Type: SMT; Operating Temperature: -40~85 °C; Series: ULN2803A; Supplier 1: LCSC; Supplier Part Number 1: C845537; Type: Driver; Live Cycle Status: 1; LCSC Part Number: C845537
U13 = SN74AVC4T774RSVR: 4-Bit Dual-Supply Bus Transceiver with configurable Voltage-Level Shifting; belongs to SN74AVC4T774RSVR; Manufacturer: Texas Instruments; Created from: MGremer; Manufacturer Part Number: SN74AVC4T774RSVR; PartID: 1; Created On: 30/11/2020 12:34:01; ComponentLink1Description: Datasheet; ComponentLink1URL: https://www.ti.com/store/ti/en/p/product/?p=SN74AVC4T774RSVR; Component Type: Level Shifter; Device Package: UQFN; Last Updated: 03/09/2024 12:45:00; Mounting Type: SMD; Supplier 1: Mouser; Supplier Part Number 1: 595-SN74AVC4T774RSVR; Supplier 2: LCSC; Supplier Part Number 2: C779392; Type: Level Shifter; Live Cycle Status: 1; LCSC Part Number: C779392; Stock number: not stored
U14 = AOZ1360AIL: 28V 3.4A Programmable Current-Limited High-Side Load Switch; Manufacturer: Alpha and Omega Semiconductor; Created from: MGeier; ComponentLink1URL: https://www.lcsc.com/datasheet/lcsc_datasheet_1809131557_Alpha---Omega-Semicon-AOZ1360AIL_C146821.pdf; ComponentLink1Description: Datasheet; Manufacturer Part Number: AOZ1360AIL; PartID: 9; Created On: 24/02/2025 16:37:30; Component Type: Power Switch ICs; Device Package: SO-8; Last Updated: 24/02/2025 16:37:30; Mounting Type: SMD; Operating Temperature: -40°C - 85°C; Series: AOZ1360; Supplier 1: LCSC; Supplier Part Number 1: C146821; Value: AOZ1360AIL; LCSC Part Number: C146821

## Sheet S2C_SelectJTAG.SchDoc
size A4; SheetNumber: 16
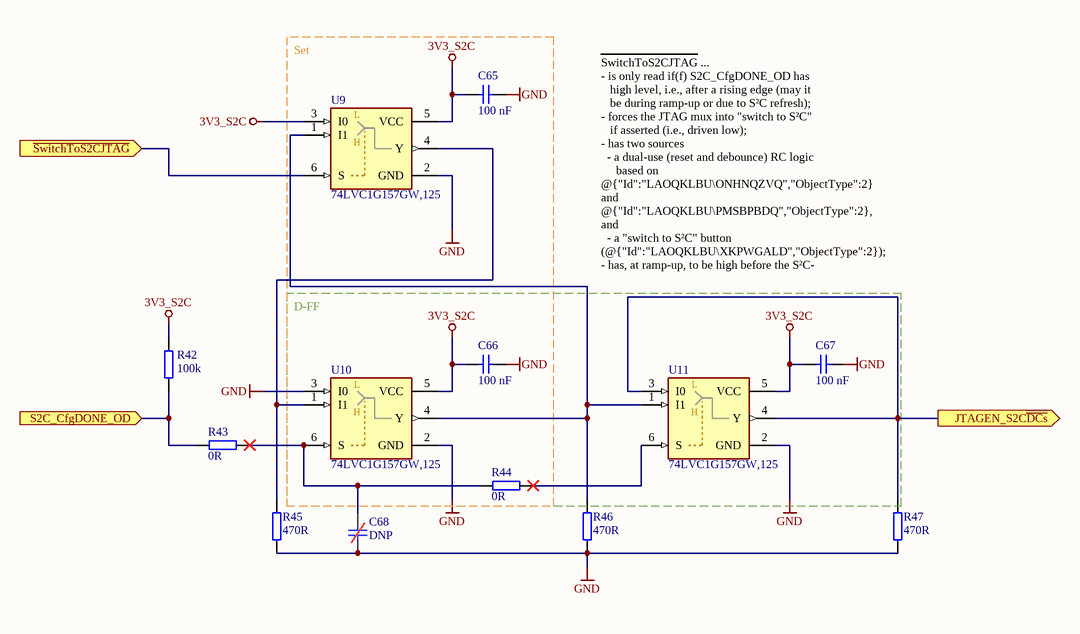
[diagram p14: S2C_SelectJTAG.SchDoc]

### Parts
C65  100 nF  [C_0603_TE]
C66  100 nF  [C_0603_TE]
C67  100 nF  [C_0603_TE]
C68  DNP  [C_0603_TE-DNP]  (no BOM)
R42  100k  [R_0603_TE]
R43  0R  [R_0603_TE]
R44  0R  [R_0603_TE]
R45  470R  [R_0603_TE]
R46  470R  [R_0603_TE]
R47  470R  [R_0603_TE]
U9  74LVC1G157GW,125  [SOT-363]
U10  74LVC1G157GW,125  [SOT-363]
U11  74LVC1G157GW,125  [SOT-363]

### Blocks framed on the sheet
D-FF: C66 C67 R44 U10 U11

### Ports
JTAGEN_S2C~{DCs} (out), S2C_CfgDONE_OD (in), ~{SwitchToS2CJTAG} (in)

### Nets
3V3_S2C: C65.2 C66.2 C67.2 R42.2 U9.3(I0) U9.5(VCC) U10.5(VCC) U11.5(VCC)
GND: C65.1 C66.1 C67.1 C68.1 R45.1 R46.1 R47.1 U9.2(GND) U10.2(GND) U10.3(I0) U11.2(GND)
DONE: R42.1 R43.2 ; port S2C_CfgDONE_OD
JTAGEN_S2C~{DCs}: R47.2 U11.3(I0) U11.4(Y) ; port JTAGEN_S2C~{DCs}
~{SwitchToS2CJTAG}: U9.6(S) ; port ~{SwitchToS2CJTAG}
NetC68_2: C68.2 R43.1 R44.2 U10.6(S)
NetR44_1: R44.1 U11.6(S)
NetR45_2: R45.2 U9.4(Y) U10.1(I1)
NetR46_2: R46.2 U9.1(I1) U10.4(Y) U11.1(I1)

### Notes on the sheet
- Set
- SwitchToS2CJTAG ...
  - is only read if(f) S2C_CfgDONE_OD has
  high level, i.e., after a rising edge (may it
  be during ramp-up or due to S²C refresh);
  - forces the JTAG mux into "switch to S²C"
  if asserted (i.e., driven low);
  - has two sources
  - a dual-use (reset and debounce) RC logic
  based on @{"Id":"LAOQKLBU\ONHNQZVQ","ObjectType":2} and @{"Id":"LAOQKLBU\PMSBPBDQ","ObjectType":2}, and
  - a "switch to S²C" button (@{"Id":"LAOQKLBU\XKPWGALD","ObjectType":2});
  - has, at ramp-up, to be high before the S²C-
  based rising edge on S2C_CfgDONE_OD
  for the switch-over (to the five D CPLDs)
  to be successful; and
  - thus needs an RC time constant in the sub-
  ms range (as config time is going to vary).
- Title
- Revision:
- Design Engineer:
- Date:
- Project:
- Sheet
- of
- (in symbol 74LVC1G157GW,125) L; H

### Library data of the parts
C65-C67 = UZgen_C_0603_100nF_50V_X7R: as C30 on sheet S2C; Manufacturer Part Number: UZgen_C_0603_100nF_50V_X7R; PartID: 1; Created On: 02/07/2024 14:42:23; Value: 100 nF; Device Package: 0603; Technology: X7R; Mounting Type: SMD; Last Updated: 08/08/2024 15:01:15
C68 = UZgen_C_0603_DNP: Generic capacitor (DNP); Manufacturer: UZgen; Created from: UZgenTool; Manufacturer Part Number: UZgen_C_0603_DNP; PartID: 5812; Created On: 29/03/2025 17:15:00; Value: DNP; Device Package: 0603; Voltage: -; Technology: -; Tolerance: -; Mounting Type: SMD; Last Updated: 02/04/2025 19:05:00
R42 = UZgen_R_0603_100k: as R54 on sheet S2C_FrontpanelInterface; Manufacturer Part Number: UZgen_R_0603_100k; PartID: 268; Created On: 02/07/2024 17:29:50; Value: 100k; Device Package: 0603; Mounting Type: SMD; Last Updated: 02/07/2024 17:29:50
R43 R44 = UZgen_R_0603_0R: Generic resistor; Manufacturer: UZgen; Tolerance: 1 %; Created from: UZgenTool; Manufacturer Part Number: UZgen_R_0603_0R; PartID: 581; Created On: 08/07/2024 14:34:30; Value: 0R; Device Package: 0603; Mounting Type: SMD; Last Updated: 08/07/2024 14:34:30
R45-R47 = UZgen_R_0603_470R: as R35 on sheet S2C; Manufacturer Part Number: UZgen_R_0603_470R; PartID: 213; Created On: 02/07/2024 17:29:49; Value: 470R; Device Package: 0603; Mounting Type: SMD; Last Updated: 02/07/2024 17:29:49
U9-U11 = 74LVC1G157GW,125: as U6 on sheet S2C_IOs3V3_SelectSPI; Manufacturer Part Number: 74LVC1G157GW,125; PartID: 21; Created On: 11/03/2025 22:40:00; ComponentLink1Description: Datasheet; ComponentLink1URL: https://assets.nexperia.com/documents/data-sheet/74LVC1G157.pdf; Component Type: Multiplexer; Device Package: TSSOP-6; Last Updated: 11/03/2025 22:40:00; Mounting Type: SMD; Operating Temperature: -40 - +125 °C; Supplier 1: LCSC; Supplier Part Number 1: C135822; Type: Multiplexer; Live Cycle Status: 1; LCSC Part Number: C135822

## Sheet isoDebug-Connectors.SchDoc
size A4; SheetNumber: 19
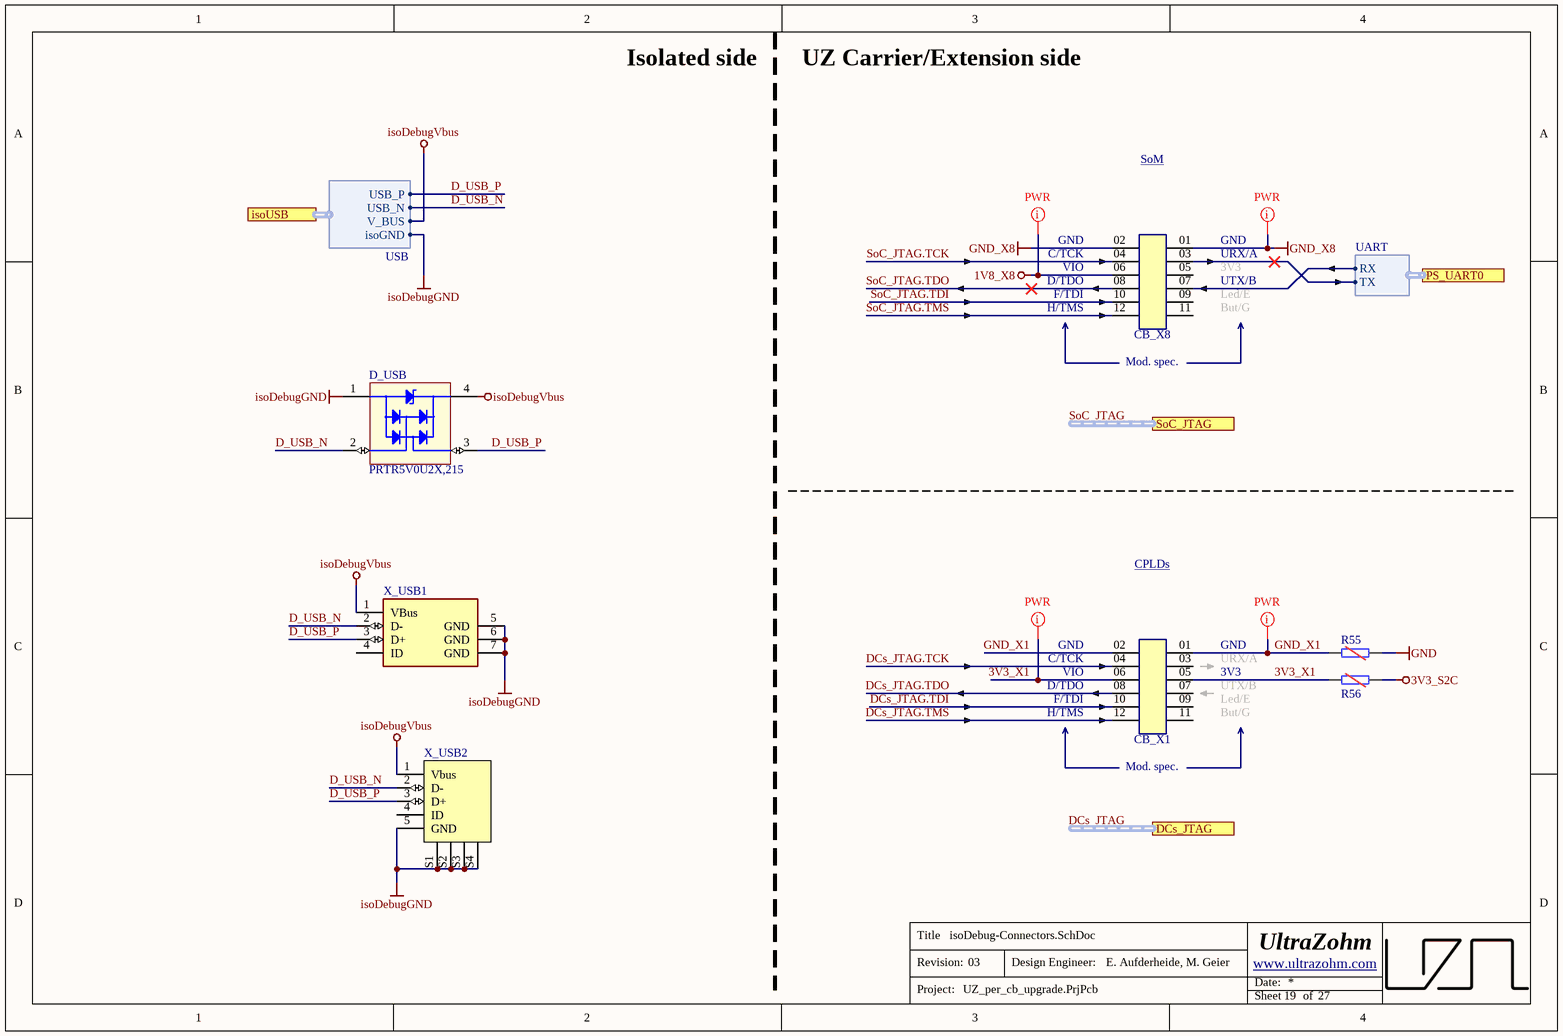
[diagram p15: isoDebug-Connectors.SchDoc]

### Parts
CB_X1  PH 0.1" SMD 2x06  [TSM-106-01-L-DV_Mirrored12+Triangle02]  (value not drawn)
CB_X8  PH 0.1" SMD 2x06  [TSM-106-01-L-DV_Mirrored12+Triangle02]  (value not drawn)
D_USB  PRTR5V0U2X,215  [SOT-143B-4]
R55  DNP  [R_1206_TE-DNP]  (value not drawn)  (no BOM)
R56  DNP  [R_1206_TE-DNP]  (value not drawn)  (no BOM)
X_USB1  Mini USB 90  [920-462A2021Y10102_CUSTOMANLRING0.2mm]  (value not drawn)
X_USB2  Mini USB  [MINI_USB_5S_B _TYPE]  (value not drawn)

### Ports
DCs_JTAG (harness JTAG), isoUSB (harness USB), PS_UART0 (harness UART), SoC_JTAG (harness JTAG)

### Harnesses
USB: USB_P, USB_N, V_BUS, isoGND
UART: RX, TX

### Nets
1V8_X8: CB_X8.06
3V3_S2C: R56.2
GND: R55.2
GND_X8: CB_X8.01 CB_X8.02
isoDebugGND: D_USB.1(GND) X_USB1.5(GND) X_USB1.6(GND) X_USB1.7(GND) X_USB2.5(GND) X_USB2.S1 X_USB2.S2 X_USB2.S3 X_USB2.S4 ; port isoUSB.isoGND
isoDebugVbus: D_USB.4(REF) X_USB1.1(VBus) X_USB2.1(Vbus) ; port isoUSB.V_BUS
3V3_X1: CB_X1.05 CB_X1.06 R56.1
D_USB_N: D_USB.2(I/O) X_USB1.2(D-) X_USB2.2(D-) ; port isoUSB.USB_N
D_USB_P: D_USB.3(I/O) X_USB1.3(D+) X_USB2.3(D+) ; port isoUSB.USB_P
DCs_JTAG.TCK: CB_X1.04
DCs_JTAG.TDI: CB_X1.10
DCs_JTAG.TDO: CB_X1.08
DCs_JTAG.TMS: CB_X1.12
GND_X1: CB_X1.01 CB_X1.02 R55.1
SoC_JTAG.TCK: CB_X8.04
SoC_JTAG.TDI: CB_X8.10
SoC_JTAG.TDO: CB_X8.08
SoC_JTAG.TMS: CB_X8.12
NetCB_X8_03: CB_X8.03 ; port PS_UART0.TX
NetCB_X8_07: CB_X8.07 ; port PS_UART0.RX

Not connected (* = marked no-connect by the designer): CB_X1 03 07 09 11; CB_X8 05 09 11; X_USB1 4(ID); X_USB2 4(ID)

### Buses and harness runs
harness DCs_JTAG = port DCs_JTAG
harness SoC_JTAG = port SoC_JTAG

### Layout directives
net class PWR: 1V8_X8, 3V3_X1, GND_X1, GND_X8

### Notes on the sheet
- Isolated side
- UZ Carrier/Extension side
- SoM
- GND
- C/TCK
- VIO
- D/TDO
- F/TDI
- H/TMS
- URX/A
- 3V3
- UTX/B
- Led/E
- But/G
- (near CB_X8) Mod. spec.
- CPLDs
- (near CB_X1) Mod. spec.
- Title
- Revision:
- Design Engineer:
- Date:
- Project:
- Sheet
- of

### Library data of the parts
CB_X1 CB_X8 = UZgen_Conn_PinHead_2x06_SMD_100mil_90deg_mirrored12triangle02: 0.1" Double-row Pin Header, 90°-to-PCB SMD, 2x06 Pins, 250V, 3A (mirrored pin rows 1/2, with triangle marker at pin 02); Manufacturer: UZgen; Pin Pitch: 0.1" x 0.1"; Pin Orientation: 90° (standing); Created from: UZgenTool; Manufacturer Part Number: UZgen_Conn_PinHead_2x06_SMD_100mil_90deg_mirrored12triangle02; PartID: 21; Created On: 27/03/2025 13:58:45; Value: PH 0.1" SMD 2x06; Device Package: SMD 0.1" 2x06; Pin Count: 12; Pin Layout: 2x06; Pin Voltage: 250V; Pin Current: 3A; Mounting Type: SMD; Last Updated: 27/03/2025 13:58:45
D_USB = PRTR5V0U2X,215: ESD Suppressors / TVS Diodes PRTR5V0U2X/SOT143/SOT4; Manufacturer: Nexperia; Created from: AGeiger; Manufacturer Part Number: PRTR5V0U2X,215; PartID: 10; Created On: 26.11.2023 17:14:11; ComponentLink1Description: Datasheet; ComponentLink1URL: https://www.mouser.de/datasheet/2/916/PRTR5V0U2X-2938759.pdf; Component Type: TVS Diode, ESD; Device Package: SOT-143B-4; Last Updated: 26.11.2023 17:16:37; Mounting Type: SMD; Operating Temperature: -40 to 85 °C; Supplier 1: Mouser; Supplier Part Number 1: 771-PRTR5V0U2X-T/R; Supplier 2: LCSC; Supplier Part Number 2: C12333; Type: TVS-Diode; Value: PRTR5V0U2X,215; Live Cycle Status: 1; LCSC Part Number: C12333
R55 R56 = UZgen_R_1206_DNP: Generic resistor (DNP); Manufacturer: UZgen; Created from: UZgenTool; Manufacturer Part Number: UZgen_R_1206_DNP; PartID: 595; Created On: 25/03/2025 14:26:15; Value: DNP; Device Package: 1206; Tolerance: -; Mounting Type: SMD; Last Updated: 02/04/2025 19:05:00
X_USB1 = 920-462A2021Y10102: USB 2.0 1 5P Female Mini-B Plugin USB Connectors ROHS; Manufacturer: Jing Extension of the Electronic Co.; Created from: FRosner; Manufacturer Part Number: 920-462A2021Y10102; PartID: 55; Created On: 28/02/2025 09:59:57; ComponentLink1Description: Datasheet; ComponentLink1URL: https://www.lcsc.com/datasheet/lcsc_datasheet_2103051832_Jing-Extension-of-the-Electronic-Co--920-462A2021Y10102_C13453.pdf; Last Updated: 23/05/2025 19:07:30; Mounting Type: SMD; Operating Temperature: -30 °C to +80 °C; Series: Mini USB; Supplier 1: LCSC; Supplier Part Number 1: C13453; Value: Mini USB 90; LCSC Part Number: C13453
X_USB2 = MINI 5PTP: 1A 1 Surface Mount 5P Female -30℃~+80℃ SMD USB Connectors ROHS; Manufacturer: SHOU HAN; Created from: AGeiger; Manufacturer Part Number: MINI 5PTP; PartID: 24; Created On: 26/11/2023 17:41:34; ComponentLink1Description: Datasheet; ComponentLink1URL: https://datasheet.lcsc.com/lcsc/2101221940_SHOU-HAN-MINI-5PTP_C2681563.pdf; Last Updated: 26/11/2023 17:41:34; Mounting Type: SMD; Operating Temperature: -30 °C to +80 °C; Series: Mini USB; Supplier 1: LCSC; Supplier Part Number 1: C2681563; Value: Mini USB; LCSC Part Number: C2681563

## Sheet X10-Isolation.SchDoc
size A4; SheetNumber: 23
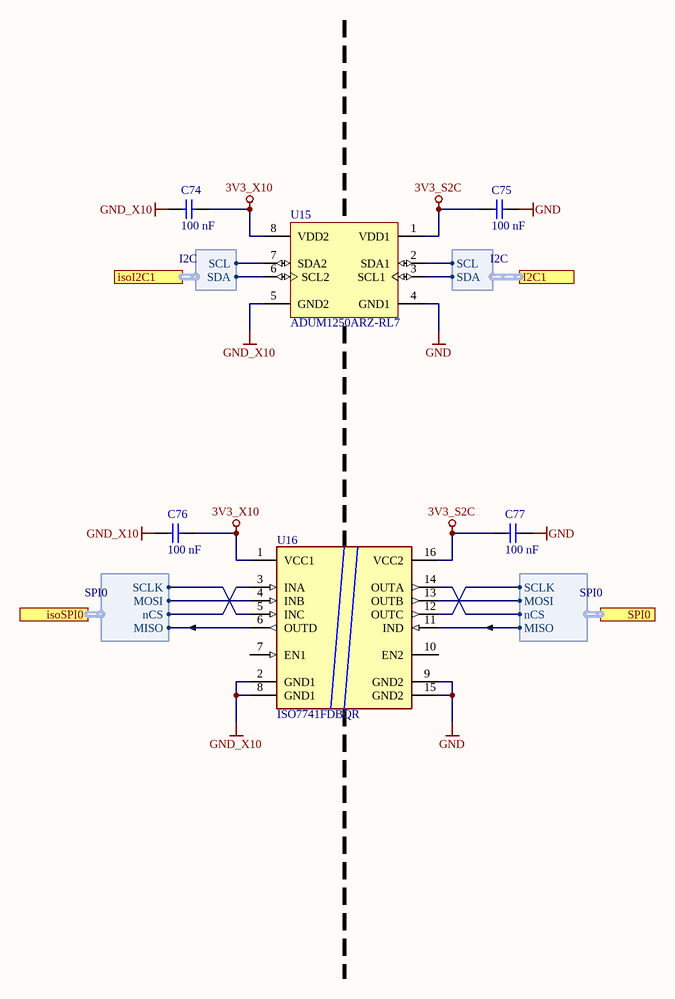
[diagram p16: X10-Isolation.SchDoc]

### Parts
C74  100 nF  [C_0603_TE]
C75  100 nF  [C_0603_TE]
C76  100 nF  [C_0603_TE]
C77  100 nF  [C_0603_TE]
U15  ADUM1250ARZ-RL7  [ADI-R-8_N]
U16  ISO7741FDBQR  [SOP64P600X175-16N]

### Ports
I2C1 (harness I2C), isoI2C1 (harness I2C), isoSPI0 (harness SPI0), SPI0 (harness SPI0)

### Harnesses
I2C: SCL, SDA
SPI0: SCLK, MOSI, MISO, nCS

### Nets
3V3_S2C: C75.2 C77.2 U15.1(VDD1) U16.16(VCC2)
3V3_X10: C74.1 C76.1 U15.8(VDD2) U16.1(VCC1)
GND: C75.1 C77.1 U15.4(GND1) U16.9(GND2) U16.15(GND2)
GND_X10: C74.2 C76.2 U15.5(GND2) U16.2(GND1) U16.8(GND1)
isoI2C1.SCL: U15.7(SDA2) ; port isoI2C1.SCL
isoI2C1.SDA: U15.6(SCL2) ; port isoI2C1.SDA
isoSPI0.MISO: U16.6(OUTD) ; port isoSPI0.MISO
isoSPI0.MOSI: U16.4(INB) ; port isoSPI0.MOSI
isoSPI0.nCS: U16.3(INA) ; port isoSPI0.nCS
isoSPI0.SCLK: U16.5(INC) ; port isoSPI0.SCLK
nCS: U16.14(OUTA) ; port SPI0.nCS
NetR25_1: U15.2(SDA1) ; port I2C1.SCL
NetR30_1: U15.3(SCL1) ; port I2C1.SDA
NetU5_31: U16.12(OUTC) ; port SPI0.SCLK
NetU5_32: U16.11(IND) ; port SPI0.MISO
NetU5_49: U16.13(OUTB) ; port SPI0.MOSI

Not connected (* = marked no-connect by the designer): U16 7(EN1) 10(EN2)

### Notes on the sheet
- Title
- Revision:
- Design Engineer:
- Date:
- Project:
- Sheet
- of

### Library data of the parts
C74-C77 = UZgen_C_0603_100nF_50V_X7R: Generic capacitor; Manufacturer: UZgen; Voltage: 50V; Tolerance: 10 %; Created from: AGeiger; Manufacturer Part Number: UZgen_C_0603_100nF_50V_X7R; PartID: 1; Created On: 02/07/2024 14:42:23; Value: 100 nF; Device Package: 0603; Technology: X7R; Mounting Type: SMD; Last Updated: 08/08/2024 15:01:15
U15 = ADUM1250ARZ-RL7: Digital Isolators DUAL-Hot-Swappable 12C Isolators; Manufacturer: Analog Devices Inc.; Created from: FRosner; ComponentLink1Description: Datasheet; ComponentLink2URL: http://www.analog.com/media/en/technical-documentation/data-sheets/ADUM1250_1251.pdf; ComponentLink1URL: https://www.mouser.de/ProductDetail/Analog-Devices/ADUM1250ARZ-RL7?qs=WIvQP4zGangN4422brPwNw%3D%3D; ComponentLink2Description: Datasheet; Manufacturer Part Number: ADUM1250ARZ-RL7; PartID: 4; Created On: 11/06/2024 20:40:52; Component Type: Digital Isolator; Device Package: SOIC-8; Last Updated: 12/07/2024 08:56:06; Mounting Type: SMD; Supplier 1: Mouser; Supplier Part Number 1: 584-ADUM1250ARZ-R7; Supplier 2: LCSC; Supplier Part Number 2: C13839; Type: Digital Isolator; Live Cycle Status: 1; LCSC Part Number: C13839; Stock number: not stored
U16 = ISO7741FDBQR: ISO774xT-Q1 High-Speed, Reinforced Quad-Channel Digital Isolators With Integrated; Manufacturer: Texas Instruments; Created from: FRosner; Manufacturer Part Number: ISO7741FDBQR; PartID: 9; Created On: 23/02/2025 18:08:33; ComponentLink1Description: Datasheet; ComponentLink1URL: https://www.ti.com/lit/ds/symlink/iso7741.pdf; Component Type: Digital Isolator; Device Package: SSOP-16; Last Updated: 26/03/2025 16:07:30; Mounting Type: SMD; Operating Temperature: -55 to +125 °C; Series: ISO7741; Supplier 1: Mouser; Supplier Part Number 1: 595-ISO7741FDBQR; Supplier 2: LCSC; Supplier Part Number 2: C2872241; Type: Digital Isolator; Value: ISO7741FDBQR; LCSC Part Number: C2872241

## Sheet X13-Isolation.SchDoc
size A4; SheetNumber: 24
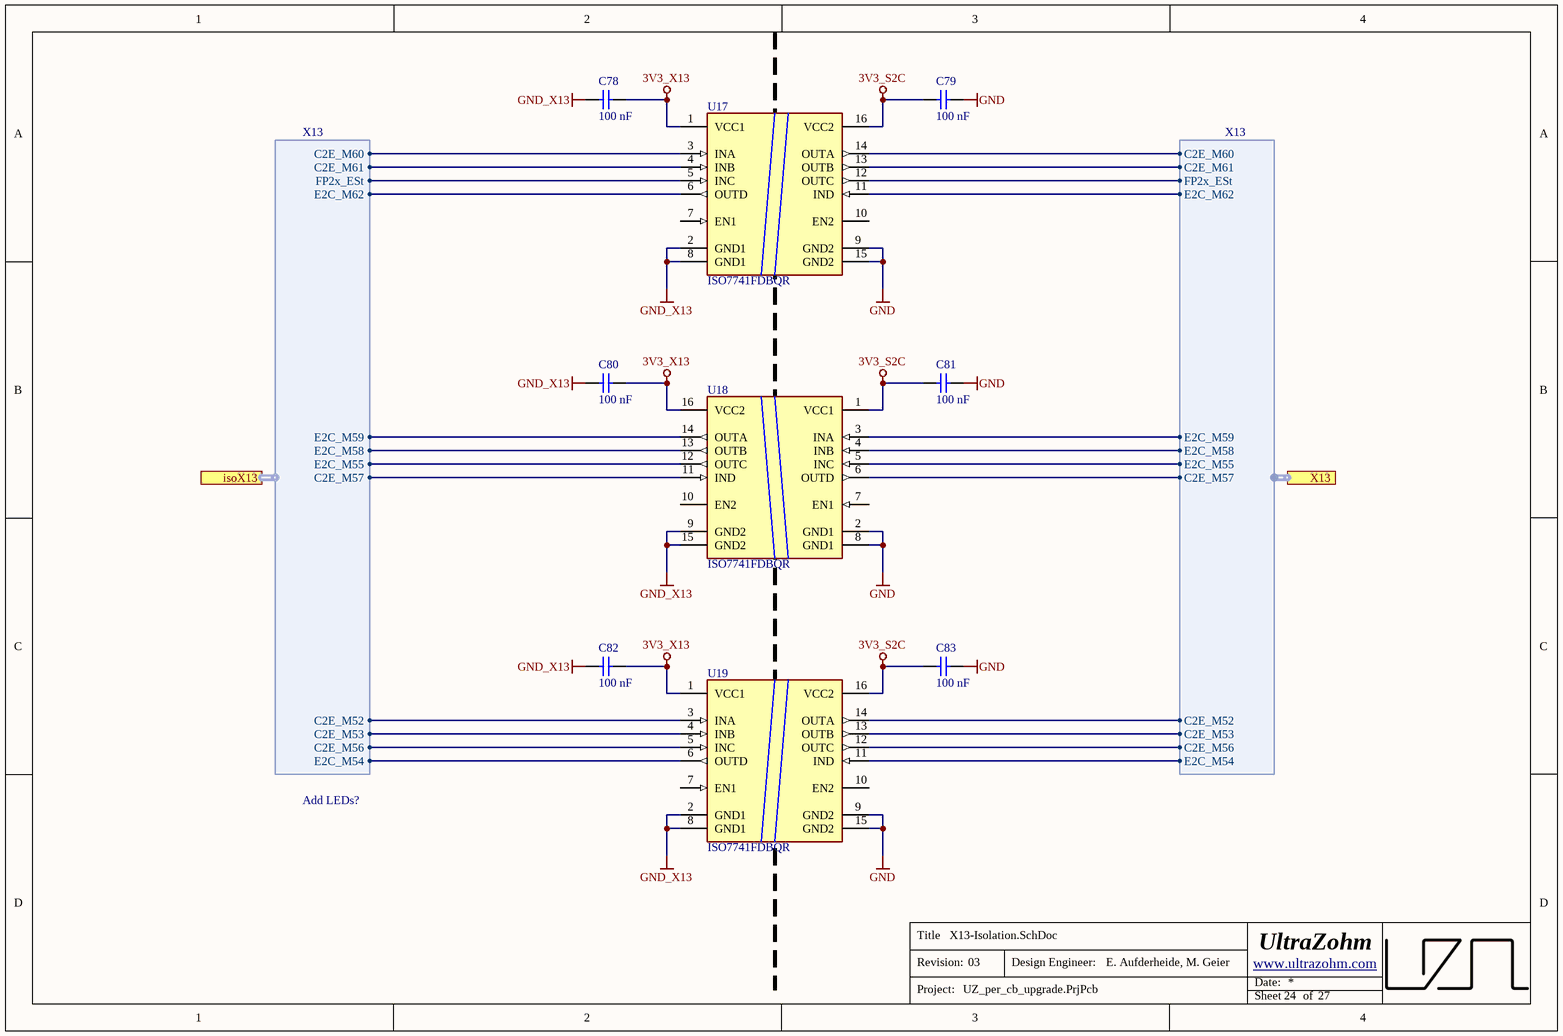
[diagram p17: X13-Isolation.SchDoc]

### Parts
C78  100 nF  [C_0603_TE]
C79  100 nF  [C_0603_TE]
C80  100 nF  [C_0603_TE]
C81  100 nF  [C_0603_TE]
C82  100 nF  [C_0603_TE]
C83  100 nF  [C_0603_TE]
U17  ISO7741FDBQR  [SOP64P600X175-16N]
U18  ISO7741FDBQR  [SOP64P600X175-16N]
U19  ISO7741FDBQR  [SOP64P600X175-16N]

### Ports
isoX13 (harness X13), X13 (harness X13)

### Harnesses
X13: C2E_M52, C2E_M53, C2E_M56, C2E_M57, C2E_M60, C2E_M61, E2C_M54, E2C_M55, E2C_M58, E2C_M59, E2C_M62, FP2x_ESt

### Nets
3V3_S2C: C79.2 C81.2 C83.2 U17.16(VCC2) U18.1(VCC1) U19.16(VCC2)
3V3_X13: C78.1 C80.1 C82.1 U17.1(VCC1) U18.16(VCC2) U19.1(VCC1)
GND: C79.1 C81.1 C83.1 U17.9(GND2) U17.15(GND2) U18.2(GND1) U18.8(GND1) U19.9(GND2) U19.15(GND2)
GND_X13: C78.2 C80.2 C82.2 U17.2(GND1) U17.8(GND1) U18.9(GND2) U18.15(GND2) U19.2(GND1) U19.8(GND1)
isoX13.C2E_M52: U19.3(INA) ; port isoX13.C2E_M52
isoX13.C2E_M53: U19.4(INB) ; port isoX13.C2E_M53
isoX13.C2E_M56: U19.5(INC) ; port isoX13.C2E_M56
isoX13.C2E_M57: U18.11(IND) ; port isoX13.C2E_M57
isoX13.C2E_M60: U17.3(INA) ; port isoX13.C2E_M60
isoX13.C2E_M61: U17.4(INB) ; port isoX13.C2E_M61
isoX13.E2C_M54: U19.6(OUTD) ; port isoX13.E2C_M54
isoX13.E2C_M55: U18.12(OUTC) ; port isoX13.E2C_M55
isoX13.E2C_M58: U18.13(OUTB) ; port isoX13.E2C_M58
isoX13.E2C_M59: U18.14(OUTA) ; port isoX13.E2C_M59
isoX13.E2C_M62: U17.6(OUTD) ; port isoX13.E2C_M62
isoX13.FP2x_ESt: U17.5(INC) ; port isoX13.FP2x_ESt
X13.C2E_M52: U19.14(OUTA) ; port X13.C2E_M52
X13.C2E_M53: U19.13(OUTB) ; port X13.C2E_M53
X13.C2E_M56: U19.12(OUTC) ; port X13.C2E_M56
X13.C2E_M57: U18.6(OUTD) ; port X13.C2E_M57
X13.C2E_M60: U17.14(OUTA) ; port X13.C2E_M60
X13.C2E_M61: U17.13(OUTB) ; port X13.C2E_M61
X13.E2C_M54: U19.11(IND) ; port X13.E2C_M54
X13.E2C_M55: U18.5(INC) ; port X13.E2C_M55
X13.E2C_M58: U18.4(INB) ; port X13.E2C_M58
X13.E2C_M59: U18.3(INA) ; port X13.E2C_M59
X13.E2C_M62: U17.11(IND) ; port X13.E2C_M62
X13.FP2x_ESt: U17.12(OUTC) ; port X13.FP2x_ESt

Not connected (* = marked no-connect by the designer): U17 7(EN1) 10(EN2); U18 7(EN1) 10(EN2); U19 7(EN1) 10(EN2)

### Notes on the sheet
- Add LEDs?
- Title
- Revision:
- Design Engineer:
- Date:
- Project:
- Sheet
- of

### Library data of the parts
C78-C83 = UZgen_C_0603_100nF_50V_X7R: as C74-C77 on sheet X10-Isolation; Manufacturer Part Number: UZgen_C_0603_100nF_50V_X7R; PartID: 1; Created On: 02/07/2024 14:42:23; Value: 100 nF; Device Package: 0603; Technology: X7R; Mounting Type: SMD; Last Updated: 08/08/2024 15:01:15
U17-U19 = ISO7741FDBQR: as U16 on sheet X10-Isolation; Manufacturer Part Number: ISO7741FDBQR; PartID: 9; Created On: 23/02/2025 18:08:33; ComponentLink1Description: Datasheet; ComponentLink1URL: https://www.ti.com/lit/ds/symlink/iso7741.pdf; Component Type: Digital Isolator; Device Package: SSOP-16; Last Updated: 26/03/2025 16:07:30; Mounting Type: SMD; Operating Temperature: -55 to +125 °C; Series: ISO7741; Supplier 1: Mouser; Supplier Part Number 1: 595-ISO7741FDBQR; Supplier 2: LCSC; Supplier Part Number 2: C2872241; Type: Digital Isolator; Value: ISO7741FDBQR; LCSC Part Number: C2872241